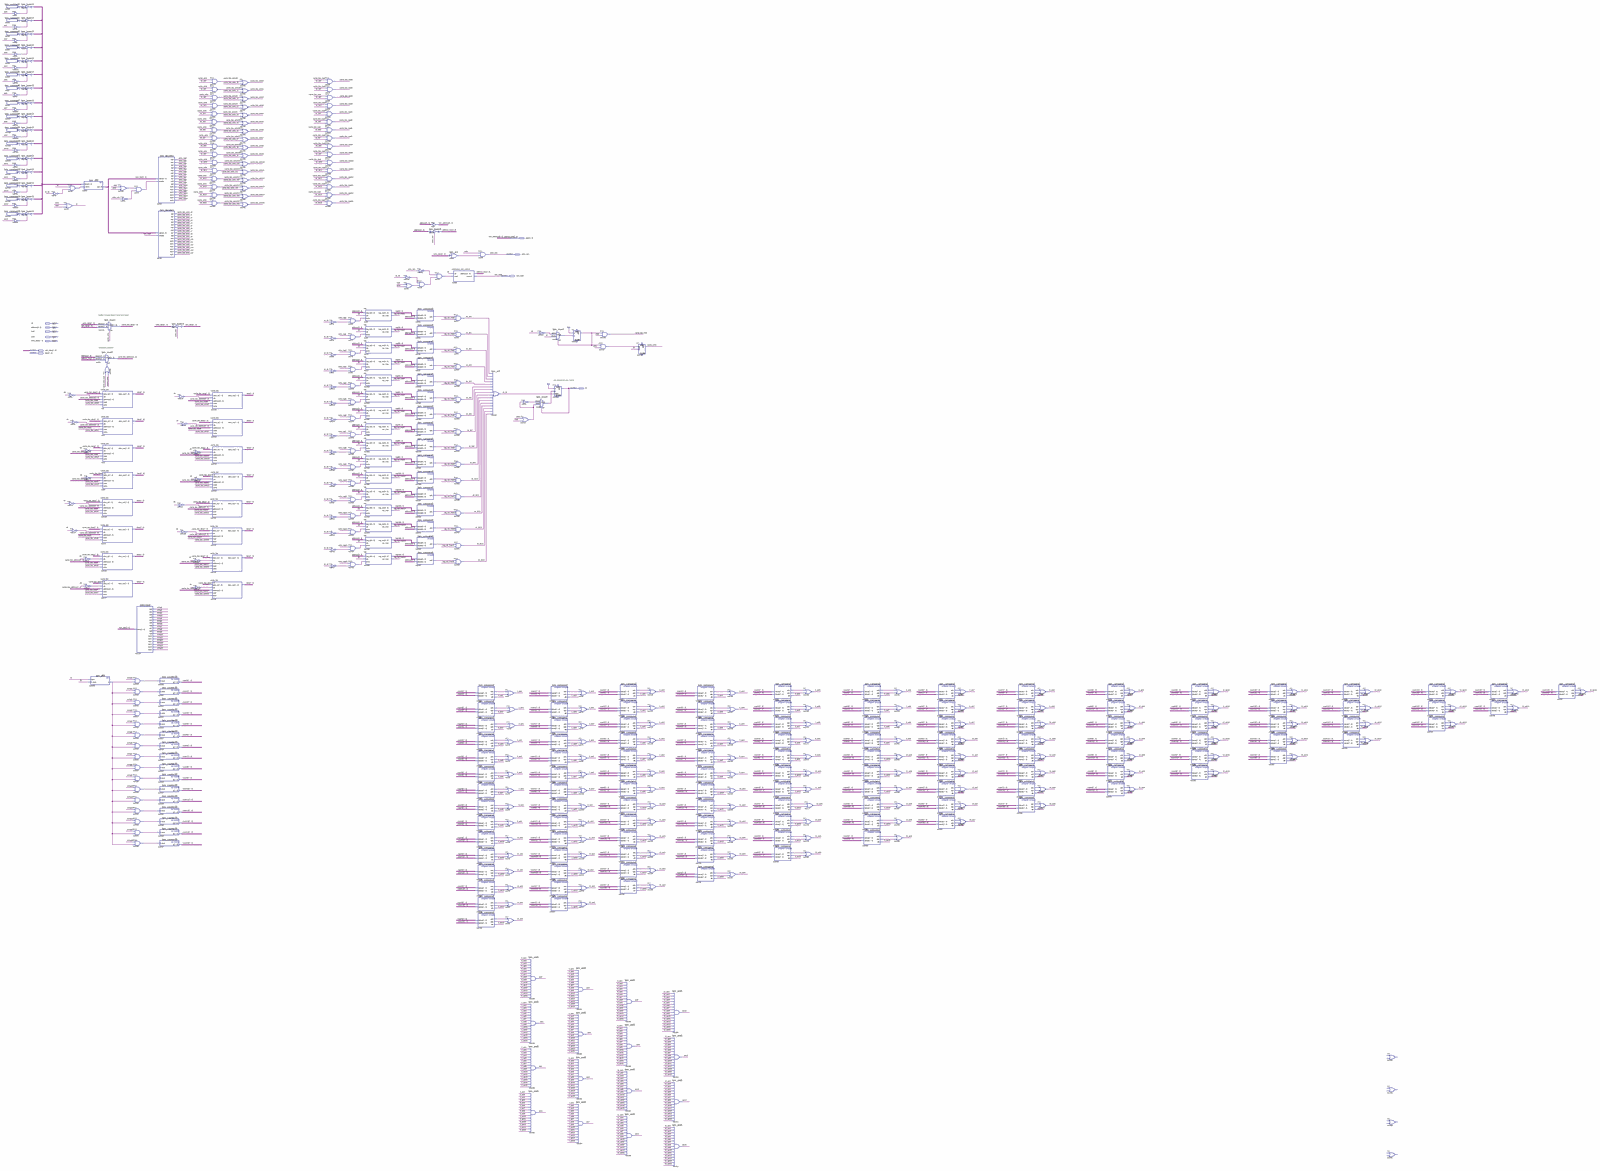
[diagram p0: schematic sheet, whole]
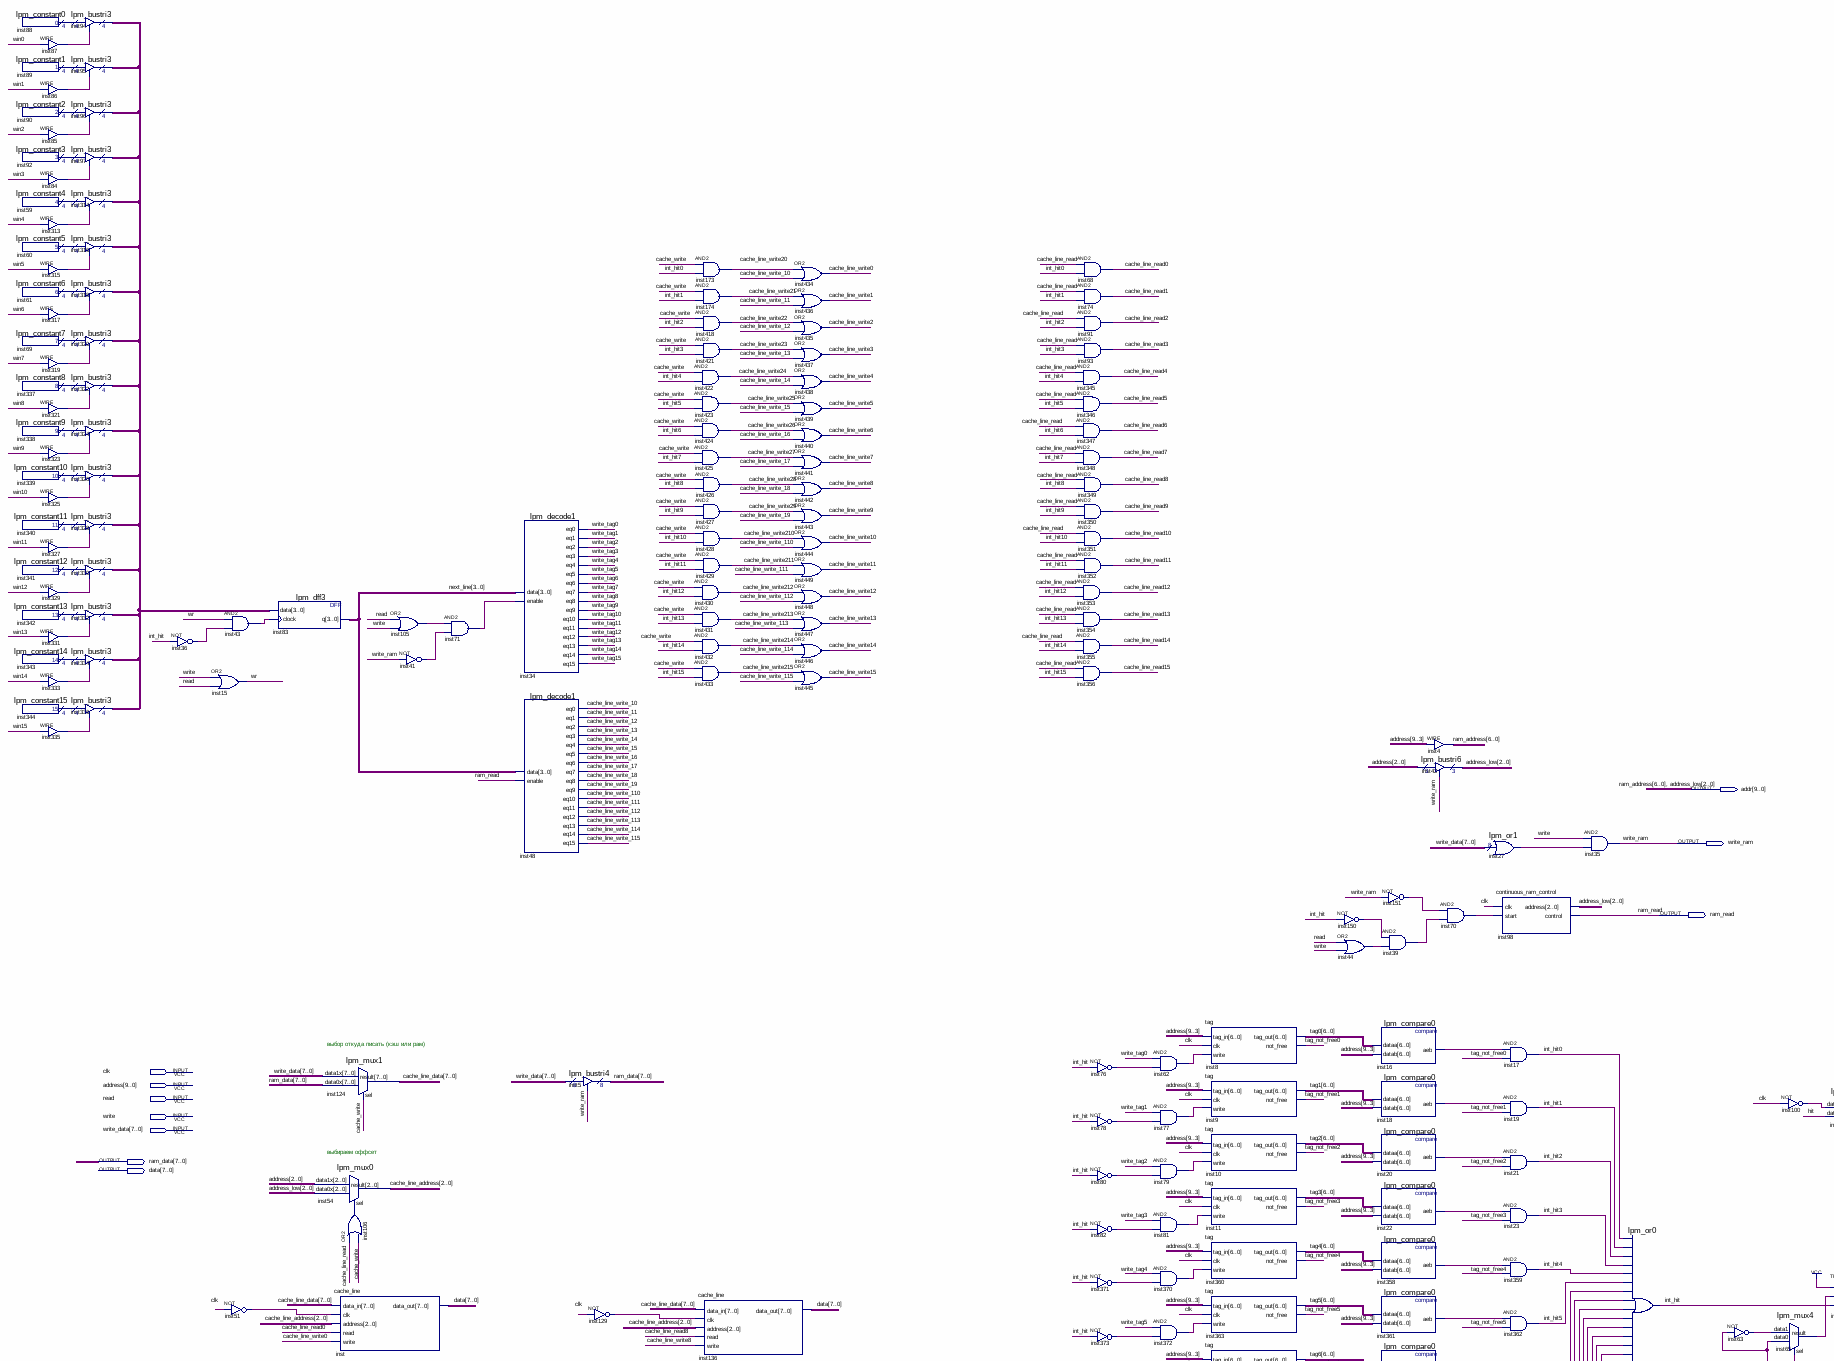
[diagram p1: schematic sheet, upper left part]
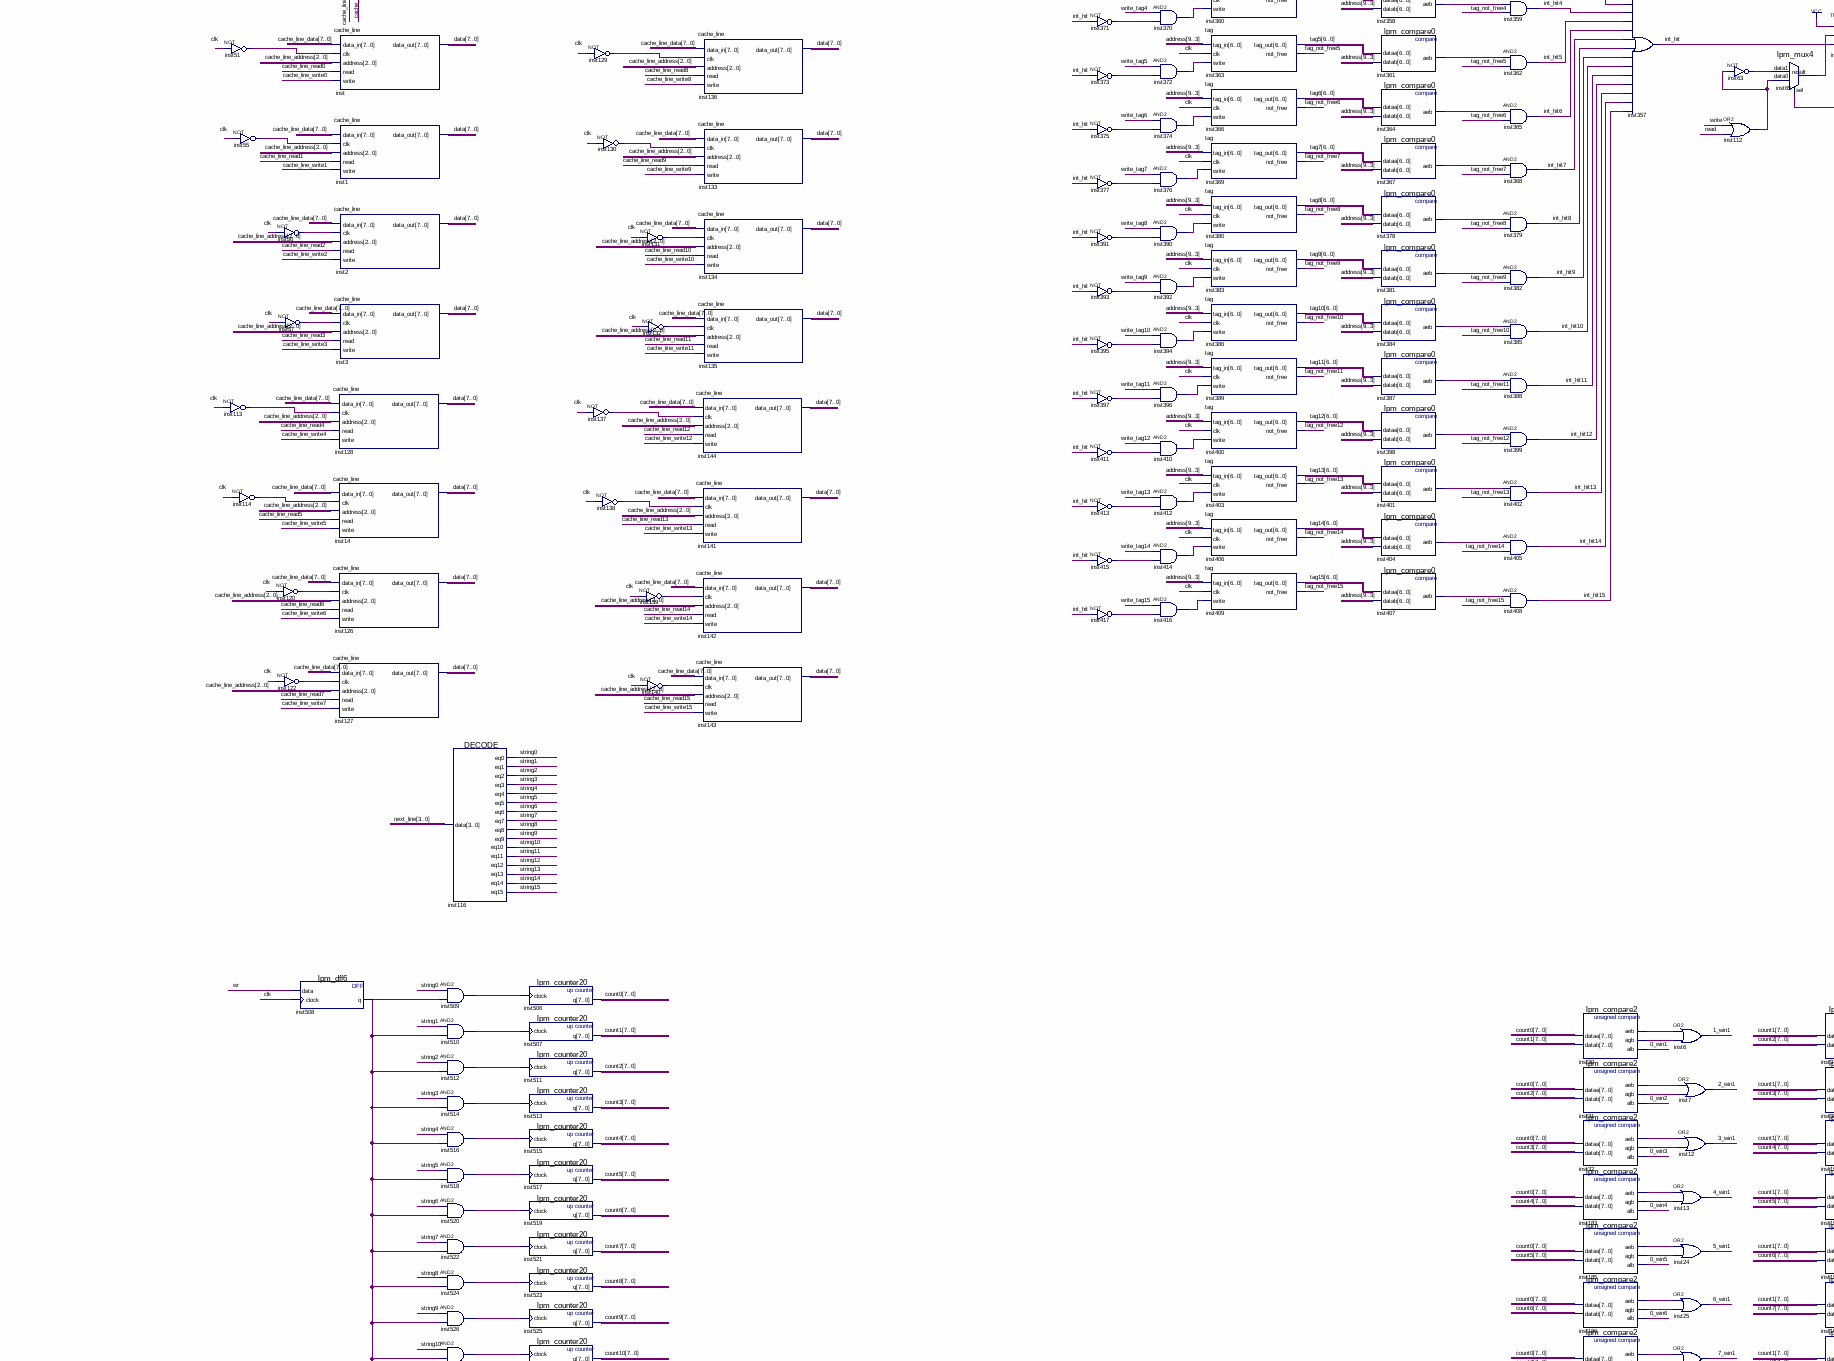
[diagram p2: schematic sheet, middle left part]
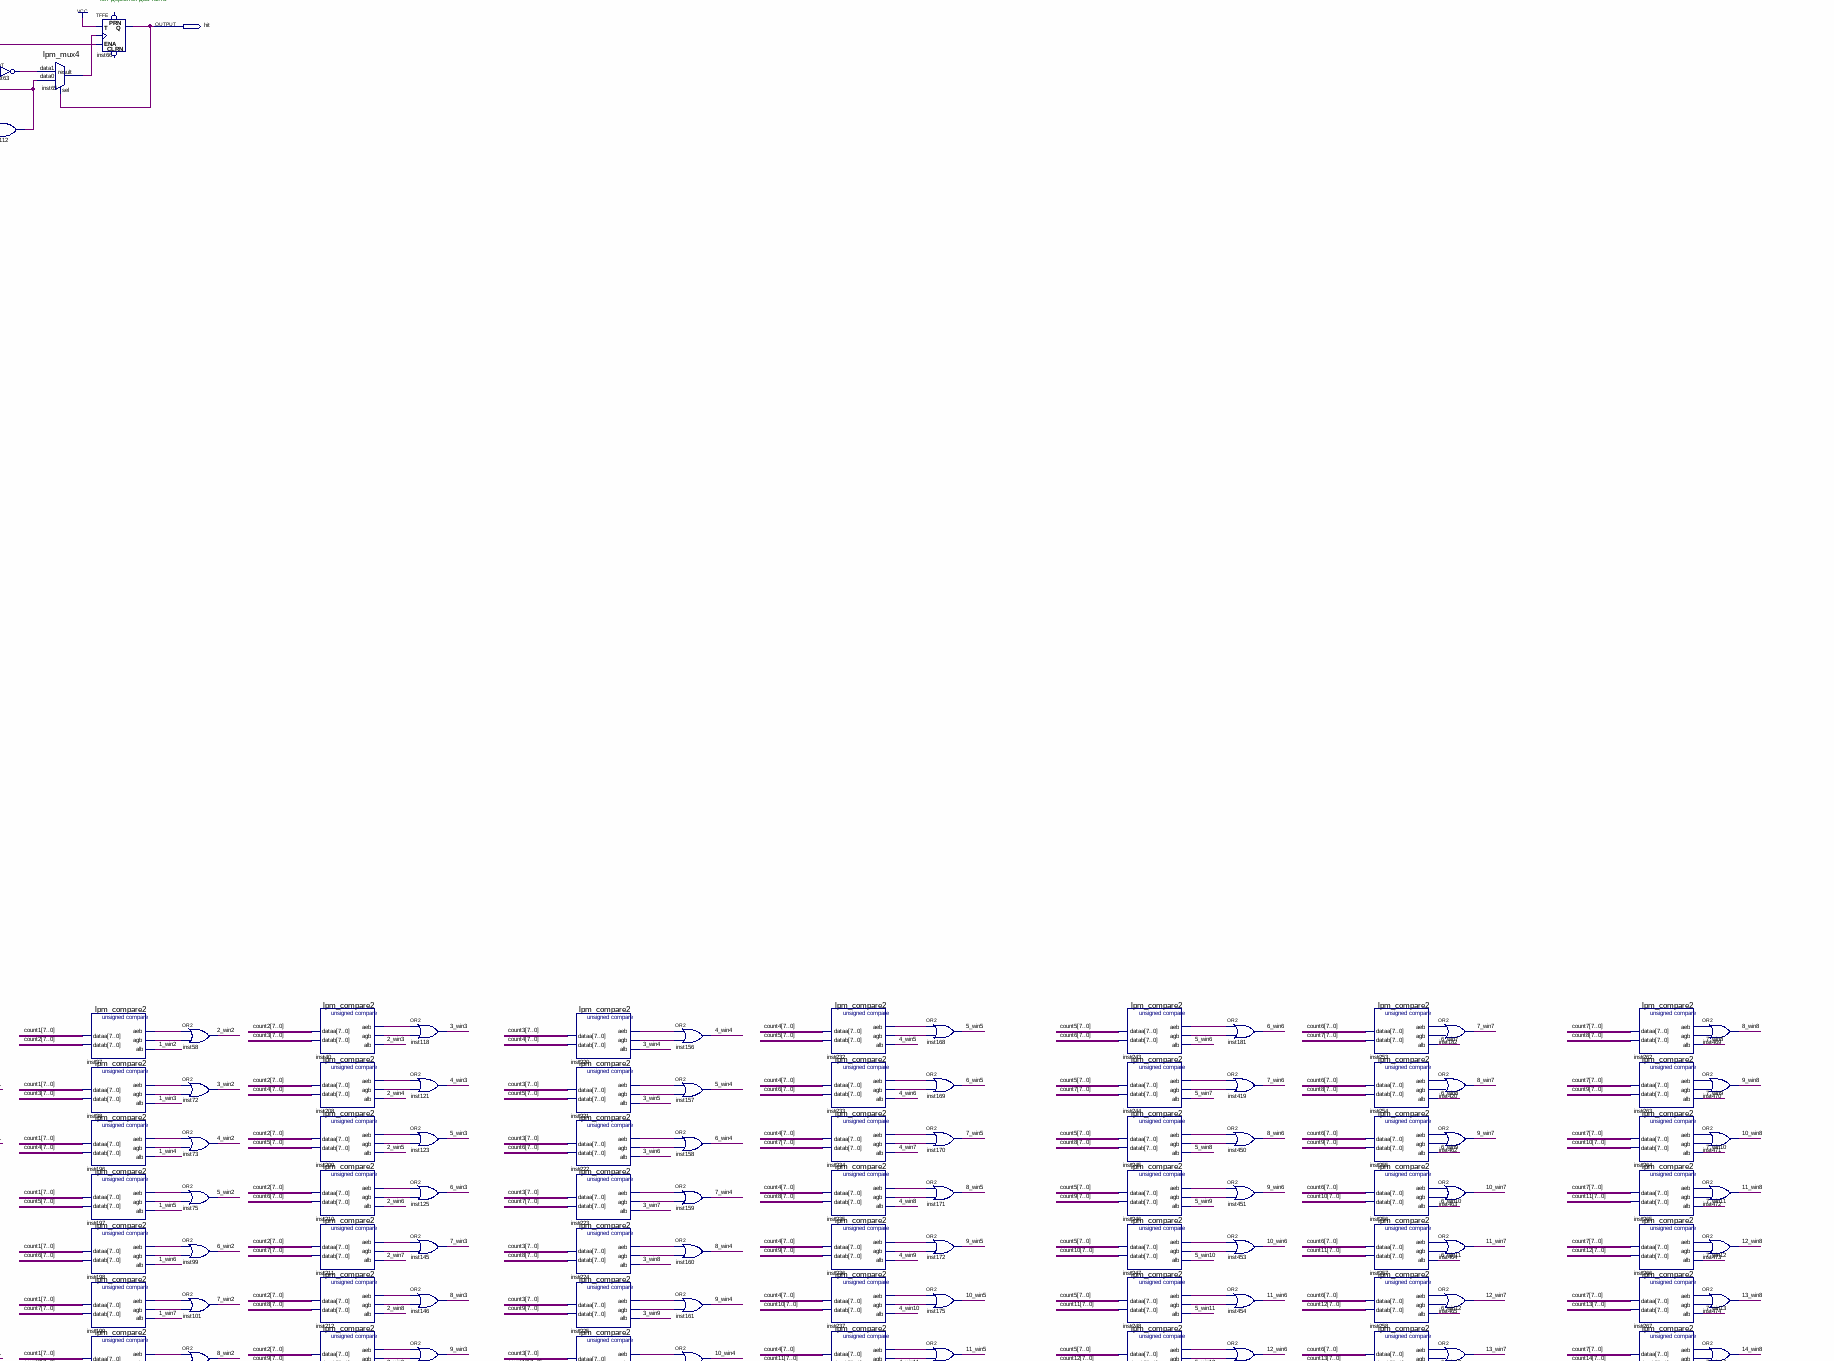
[diagram p3: schematic sheet, middle centre part]
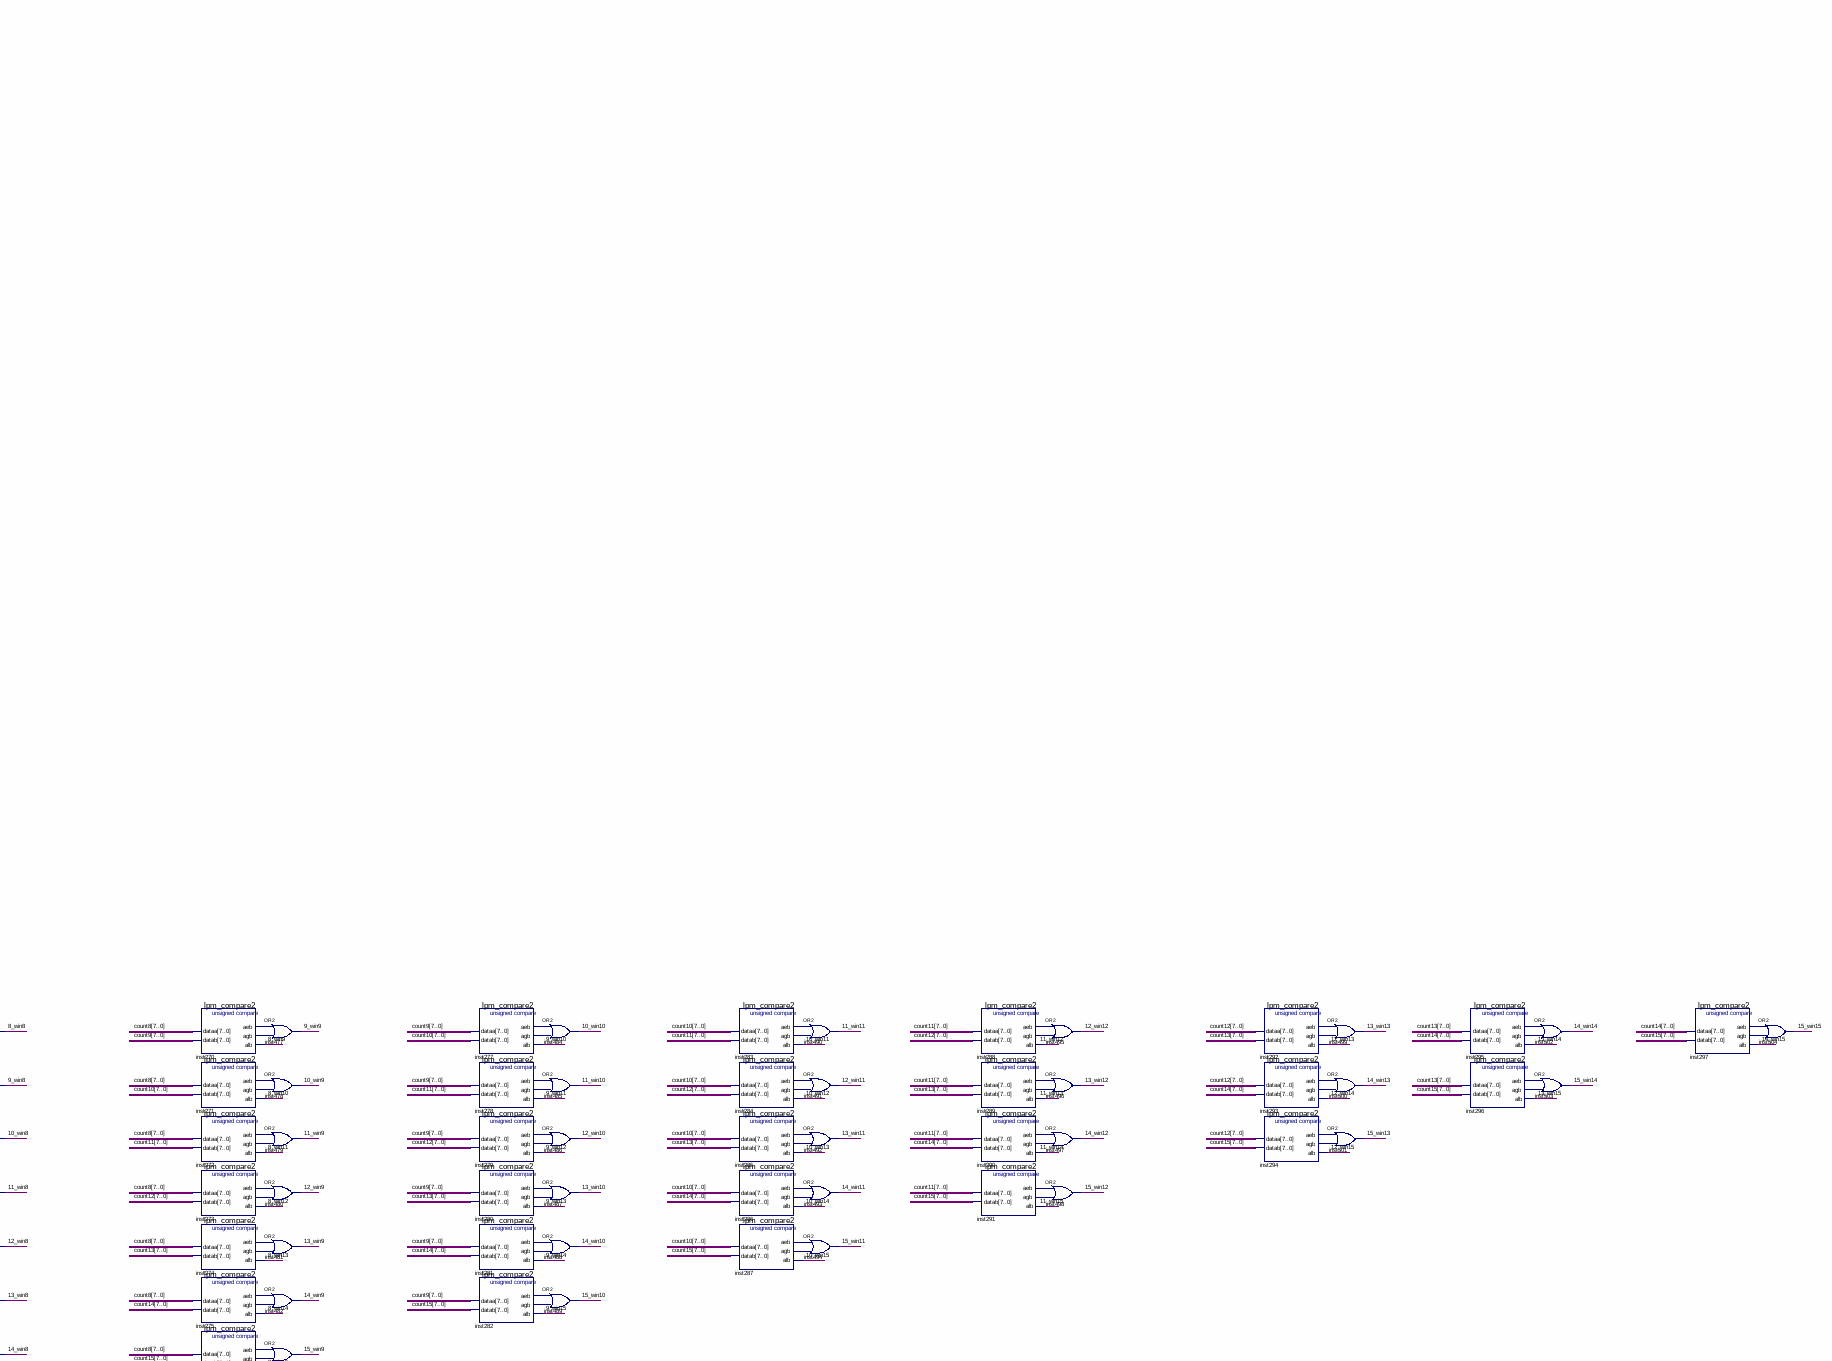
[diagram p4: schematic sheet, middle right part]
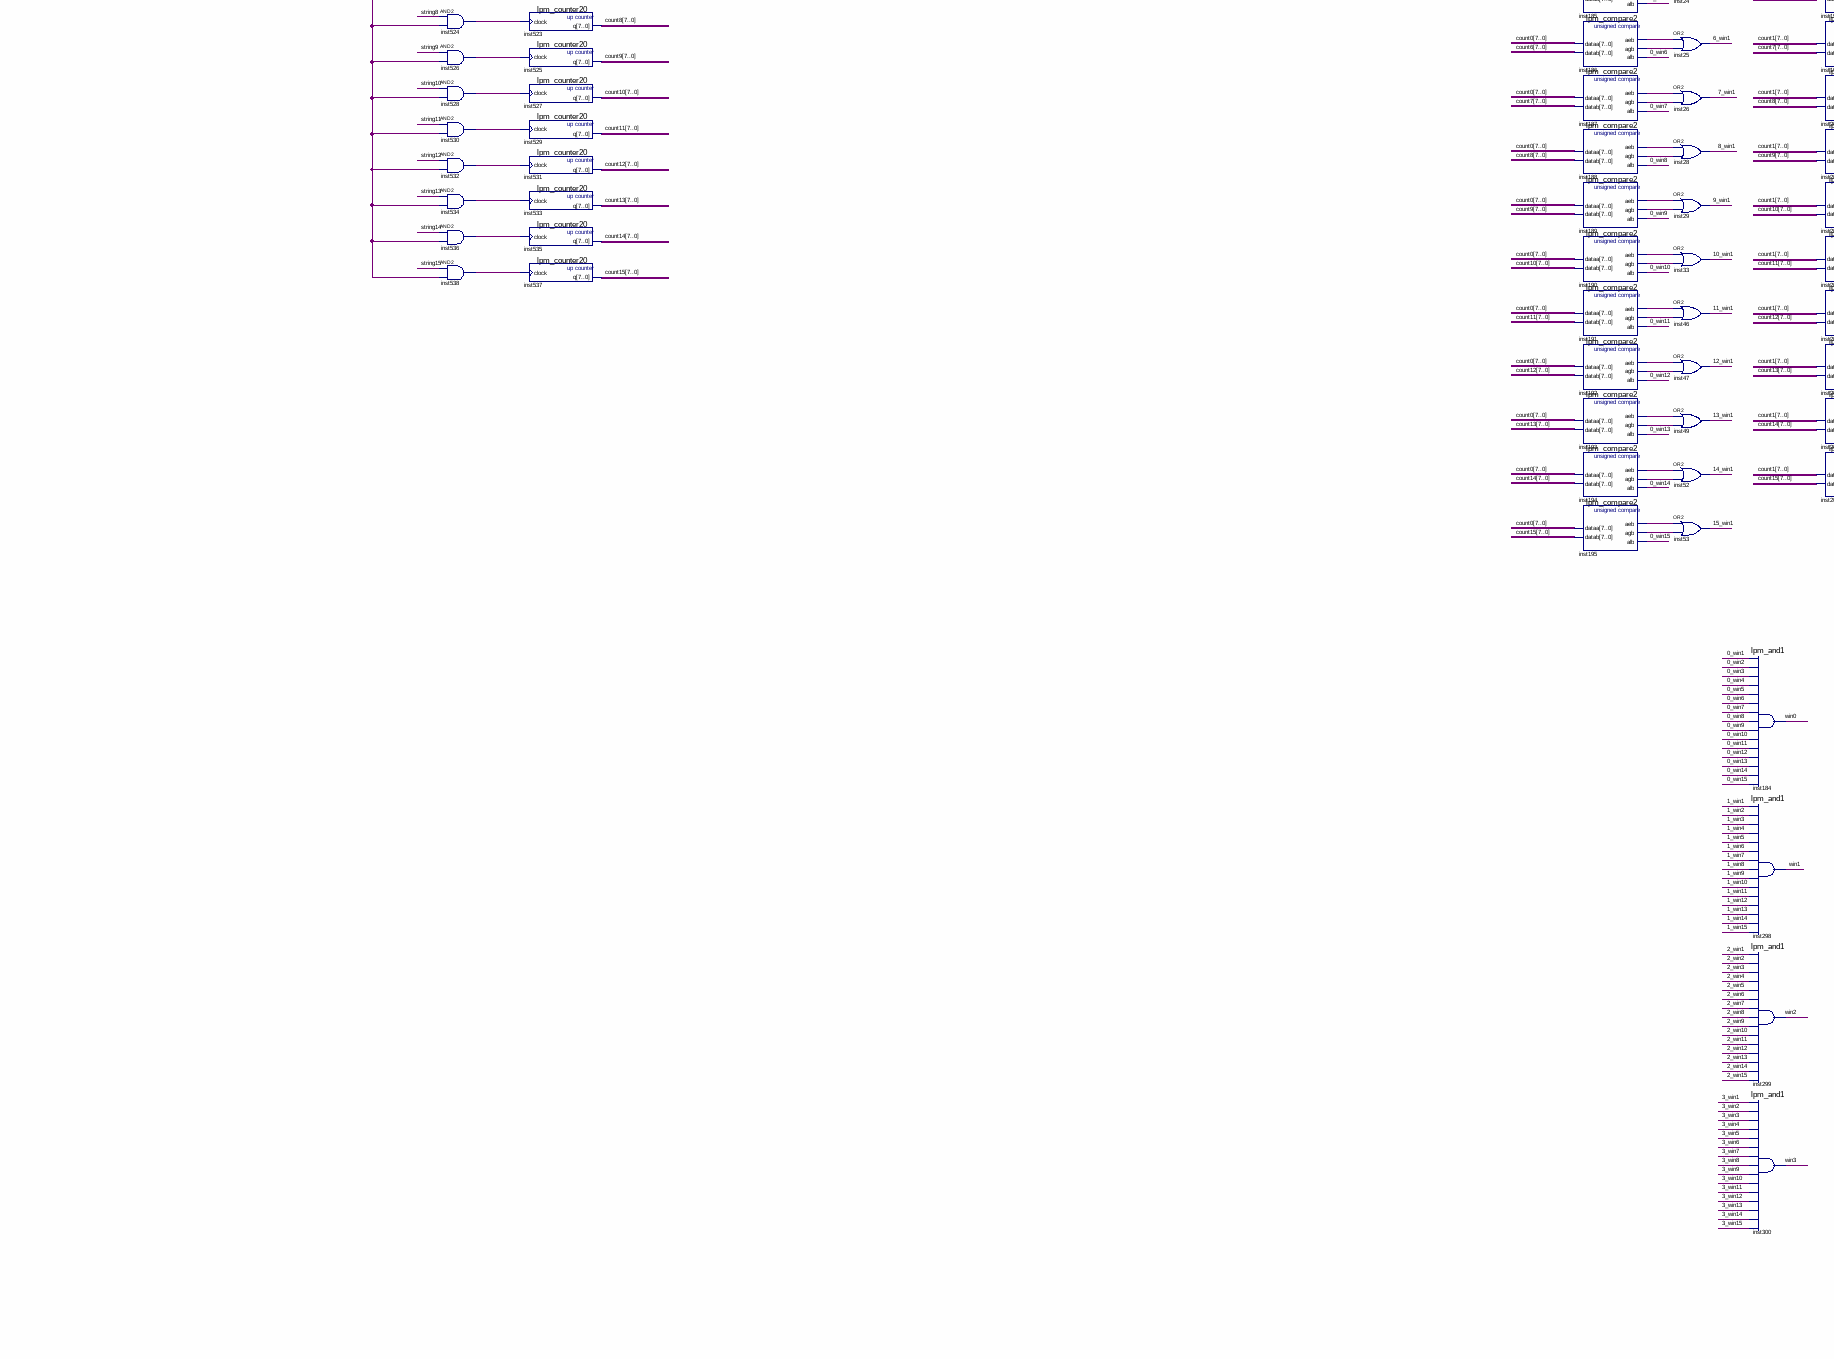
[diagram p5: schematic sheet, lower left part]
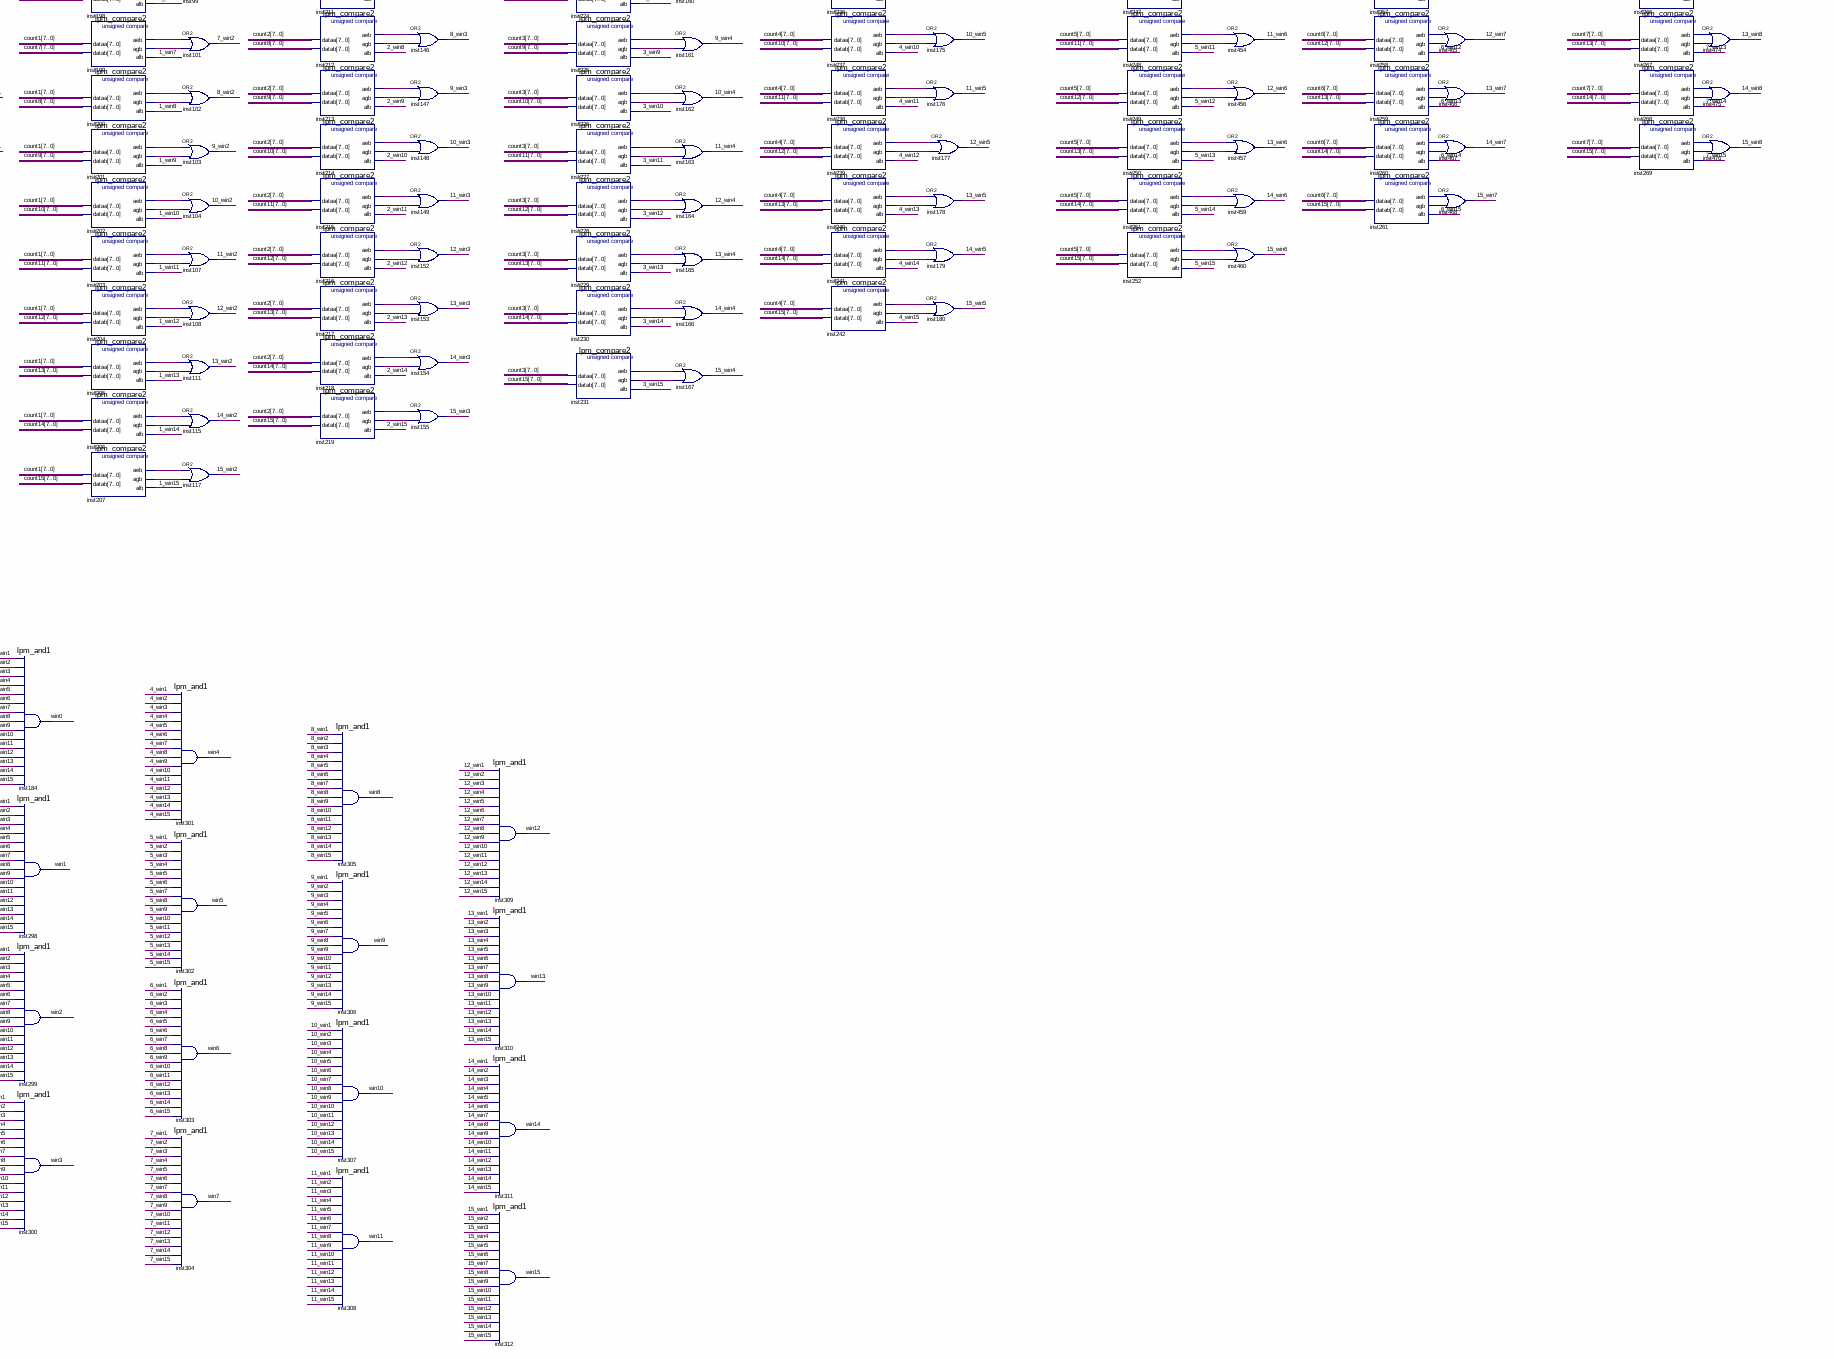
[diagram p6: schematic sheet, lower centre part]
// Quartus schematic cache.bdf as structural Verilog: 536 symbols, 11 pins
module cache (
  input  clk,
  input  [9:0] address,
  input  read,
  input  write,
  input  [7:0] write_data,
  output [9:0] addr,
  output write_ram,
  output ram_read,
  output [7:0] ram_data,
  output [7:0] data,
  output hit
);

  wire \0_win1 , \0_win2 , \0_win3 , \0_win4 , \0_win5 , \0_win6 , \0_win7 , \0_win8 , \0_win9 , \0_win10 ,
       \0_win11 , \0_win12 , \0_win13 , \0_win14 , \0_win15 , \1_win1 , \1_win2 , \1_win3 , \1_win4 ,
       \1_win5 , \1_win6 , \1_win7 , \1_win8 , \1_win9 , \1_win10 , \1_win11 , \1_win12 , \1_win13 ,
       \1_win14 , \1_win15 , \2_win1 , \2_win2 , \2_win3 , \2_win4 , \2_win5 , \2_win6 , \2_win7 , \2_win8 ,
       \2_win9 , \2_win10 , \2_win11 , \2_win12 , \2_win13 , \2_win14 , \2_win15 , \3_win1 , \3_win2 ,
       \3_win3 , \3_win4 , \3_win5 , \3_win6 , \3_win7 , \3_win8 , \3_win9 , \3_win10 , \3_win11 , \3_win12 ,
       \3_win13 , \3_win14 , \3_win15 , \4_win1 , \4_win2 , \4_win3 , \4_win4 , \4_win5 , \4_win6 , \4_win7 ,
       \4_win8 , \4_win9 , \4_win10 , \4_win11 , \4_win12 , \4_win13 , \4_win14 , \4_win15 , \5_win1 ,
       \5_win2 , \5_win3 , \5_win4 , \5_win5 , \5_win6 , \5_win7 , \5_win8 , \5_win9 , \5_win10 , \5_win11 ,
       \5_win12 , \5_win13 , \5_win14 , \5_win15 , \6_win1 , \6_win2 , \6_win3 , \6_win4 , \6_win5 ,
       \6_win6 , \6_win7 , \6_win8 , \6_win9 , \6_win10 , \6_win11 , \6_win12 , \6_win13 , \6_win14 ,
       \6_win15 , \7_win1 , \7_win2 , \7_win3 , \7_win4 , \7_win5 , \7_win6 , \7_win7 , \7_win8 , \7_win9 ,
       \7_win10 , \7_win11 , \7_win12 , \7_win13 , \7_win14 , \7_win15 , \8_win1 , \8_win2 , \8_win3 ,
       \8_win4 , \8_win5 , \8_win6 , \8_win7 , \8_win8 , \8_win9 , \8_win10 , \8_win11 , \8_win12 ,
       \8_win13 , \8_win14 , \8_win15 , \9_win1 , \9_win2 , \9_win3 , \9_win4 , \9_win5 , \9_win6 , \9_win7 ,
       \9_win8 , \9_win9 , \9_win10 , \9_win11 , \9_win12 , \9_win13 , \9_win14 , \9_win15 , \10_win1 ,
       \10_win2 , \10_win3 , \10_win4 , \10_win5 , \10_win6 , \10_win7 , \10_win8 , \10_win9 , \10_win10 ,
       \10_win11 , \10_win12 , \10_win13 , \10_win14 , \10_win15 , \11_win1 , \11_win2 , \11_win3 ,
       \11_win4 , \11_win5 , \11_win6 , \11_win7 , \11_win8 , \11_win9 , \11_win10 , \11_win11 , \11_win12 ,
       \11_win13 , \11_win14 , \11_win15 , \12_win1 , \12_win2 , \12_win3 , \12_win4 , \12_win5 , \12_win6 ,
       \12_win7 , \12_win8 , \12_win9 , \12_win10 , \12_win11 , \12_win12 , \12_win13 , \12_win14 ,
       \12_win15 , \13_win1 , \13_win2 , \13_win3 , \13_win4 , \13_win5 , \13_win6 , \13_win7 , \13_win8 ,
       \13_win9 , \13_win10 , \13_win11 , \13_win12 , \13_win13 , \13_win14 , \13_win15 , \14_win1 ,
       \14_win2 , \14_win3 , \14_win4 , \14_win5 , \14_win6 , \14_win7 , \14_win8 , \14_win9 , \14_win10 ,
       \14_win11 , \14_win12 , \14_win13 , \14_win14 , \14_win15 , \15_win1 , \15_win2 , \15_win3 ,
       \15_win4 , \15_win5 , \15_win6 , \15_win7 , \15_win8 , \15_win9 , \15_win10 , \15_win11 , \15_win12 ,
       \15_win13 , \15_win14 , \15_win15 , cache_line_read, cache_line_read0, cache_line_read1,
       cache_line_read2, cache_line_read3, cache_line_read4, cache_line_read5, cache_line_read6,
       cache_line_read7, cache_line_read8, cache_line_read9, cache_line_read10, cache_line_read11,
       cache_line_read12, cache_line_read13, cache_line_read14, cache_line_read15, cache_line_write0,
       cache_line_write1, cache_line_write2, cache_line_write3, cache_line_write4, cache_line_write5,
       cache_line_write6, cache_line_write7, cache_line_write8, cache_line_write9, cache_line_write10,
       cache_line_write11, cache_line_write12, cache_line_write13, cache_line_write14, cache_line_write15,
       cache_line_write20, cache_line_write21, cache_line_write22, cache_line_write23, cache_line_write24,
       cache_line_write25, cache_line_write26, cache_line_write27, cache_line_write28, cache_line_write29,
       cache_line_write210, cache_line_write211, cache_line_write212, cache_line_write213,
       cache_line_write214, cache_line_write215, cache_line_write_10, cache_line_write_11,
       cache_line_write_12, cache_line_write_13, cache_line_write_14, cache_line_write_15,
       cache_line_write_16, cache_line_write_17, cache_line_write_18, cache_line_write_19,
       cache_line_write_110, cache_line_write_111, cache_line_write_112, cache_line_write_113,
       cache_line_write_114, cache_line_write_115, cache_write, inst16_aeb, inst18_aeb, inst20_aeb,
       inst22_aeb, inst27_result, inst30_aeb, inst30_agb, inst31_aeb, inst31_agb, inst32_aeb, inst32_agb,
       inst36_out, inst37_aeb, inst37_agb, inst38_aeb, inst38_agb, inst39_out, inst40_aeb, inst40_agb,
       inst41_out, inst43_out, inst44_out, inst50_result, inst51_out, inst55_out, inst56_out, inst57_out,
       inst62_out, inst63_out, inst64_q, inst65_result, inst70_out, inst71_out, inst76_out, inst77_out,
       inst78_out, inst79_out, inst80_out, inst81_out, inst82_out, inst84_out, inst85_out, inst86_out,
       inst87_out, inst100_out, inst105_out, inst106_out, inst110_out, inst112_out, inst113_out, inst114_out,
       inst120_out, inst122_out, inst129_out, inst130_out, inst131_out, inst132_out, inst137_out,
       inst138_out, inst139_out, inst140_out, inst150_out, inst151_out, inst183_aeb, inst183_agb,
       inst185_aeb, inst185_agb, inst186_aeb, inst186_agb, inst187_aeb, inst187_agb, inst188_aeb,
       inst188_agb, inst189_aeb, inst189_agb, inst190_aeb, inst190_agb, inst191_aeb, inst191_agb,
       inst192_aeb, inst192_agb, inst193_aeb, inst193_agb, inst194_aeb, inst194_agb, inst195_aeb,
       inst195_agb, inst196_aeb, inst196_agb, inst197_aeb, inst197_agb, inst198_aeb, inst198_agb,
       inst199_aeb, inst199_agb, inst200_aeb, inst200_agb, inst201_aeb, inst201_agb, inst202_aeb,
       inst202_agb, inst203_aeb, inst203_agb, inst204_aeb, inst204_agb, inst205_aeb, inst205_agb,
       inst206_aeb, inst206_agb, inst207_aeb, inst207_agb, inst208_aeb, inst208_agb, inst209_aeb,
       inst209_agb, inst210_aeb, inst210_agb, inst211_aeb, inst211_agb, inst212_aeb, inst212_agb,
       inst213_aeb, inst213_agb, inst214_aeb, inst214_agb, inst215_aeb, inst215_agb, inst216_aeb,
       inst216_agb, inst217_aeb, inst217_agb, inst218_aeb, inst218_agb, inst219_aeb, inst219_agb,
       inst220_aeb, inst220_agb, inst221_aeb, inst221_agb, inst222_aeb, inst222_agb, inst223_aeb,
       inst223_agb, inst224_aeb, inst224_agb, inst225_aeb, inst225_agb, inst226_aeb, inst226_agb,
       inst227_aeb, inst227_agb, inst228_aeb, inst228_agb, inst229_aeb, inst229_agb, inst230_aeb,
       inst230_agb, inst231_aeb, inst231_agb, inst232_aeb, inst232_agb, inst233_aeb, inst233_agb,
       inst234_aeb, inst234_agb, inst235_aeb, inst235_agb, inst236_aeb, inst236_agb, inst237_aeb,
       inst237_agb, inst238_aeb, inst238_agb, inst239_aeb, inst239_agb, inst240_aeb, inst240_agb,
       inst241_aeb, inst241_agb, inst242_aeb, inst242_agb, inst243_aeb, inst243_agb, inst244_aeb,
       inst244_agb, inst245_aeb, inst245_agb, inst246_aeb, inst246_agb, inst247_aeb, inst247_agb,
       inst248_aeb, inst248_agb, inst249_aeb, inst249_agb, inst250_aeb, inst250_agb, inst251_aeb,
       inst251_agb, inst252_aeb, inst252_agb, inst253_aeb, inst253_agb, inst254_aeb, inst254_agb,
       inst255_aeb, inst255_agb, inst256_aeb, inst256_agb, inst257_aeb, inst257_agb, inst258_aeb,
       inst258_agb, inst259_aeb, inst259_agb, inst260_aeb, inst260_agb, inst261_aeb, inst261_agb,
       inst262_aeb, inst262_agb, inst263_aeb, inst263_agb, inst264_aeb, inst264_agb, inst265_aeb,
       inst265_agb, inst266_aeb, inst266_agb, inst267_aeb, inst267_agb, inst268_aeb, inst268_agb,
       inst269_aeb, inst269_agb, inst270_aeb, inst270_agb, inst271_aeb, inst271_agb, inst272_aeb,
       inst272_agb, inst273_aeb, inst273_agb, inst274_aeb, inst274_agb, inst275_aeb, inst275_agb,
       inst276_aeb, inst276_agb, inst277_aeb, inst277_agb, inst278_aeb, inst278_agb, inst279_aeb,
       inst279_agb, inst280_aeb, inst280_agb, inst281_aeb, inst281_agb, inst282_aeb, inst282_agb,
       inst283_aeb, inst283_agb, inst284_aeb, inst284_agb, inst285_aeb, inst285_agb, inst286_aeb,
       inst286_agb, inst287_aeb, inst287_agb, inst288_aeb, inst288_agb, inst289_aeb, inst289_agb,
       inst290_aeb, inst290_agb, inst291_aeb, inst291_agb, inst292_aeb, inst292_agb, inst293_aeb,
       inst293_agb, inst294_aeb, inst294_agb, inst295_aeb, inst295_agb, inst296_aeb, inst296_agb,
       inst297_aeb, inst297_agb, inst313_out, inst315_out, inst317_out, inst319_out, inst321_out,
       inst323_out, inst325_out, inst327_out, inst329_out, inst331_out, inst333_out, inst335_out,
       inst358_aeb, inst361_aeb, inst364_aeb, inst367_aeb, inst370_out, inst371_out, inst372_out,
       inst373_out, inst374_out, inst375_out, inst376_out, inst377_out, inst378_aeb, inst381_aeb,
       inst384_aeb, inst387_aeb, inst390_out, inst391_out, inst392_out, inst393_out, inst394_out,
       inst395_out, inst396_out, inst397_out, inst398_aeb, inst401_aeb, inst404_aeb, inst407_aeb,
       inst410_out, inst411_out, inst412_out, inst413_out, inst414_out, inst415_out, inst416_out,
       inst417_out, inst508_q, inst509_out, inst510_out, inst512_out, inst514_out, inst516_out, inst518_out,
       inst520_out, inst522_out, inst524_out, inst526_out, inst528_out, inst530_out, inst532_out,
       inst534_out, inst536_out, inst538_out, int_hit, int_hit0, int_hit1, int_hit2, int_hit3, int_hit4,
       int_hit5, int_hit6, int_hit7, int_hit8, int_hit9, int_hit10, int_hit11, int_hit12, int_hit13,
       int_hit14, int_hit15, string0, string1, string2, string3, string4, string5, string6, string7, string8,
       string9, string10, string11, string12, string13, string14, string15, tag_not_free0, tag_not_free1,
       tag_not_free2, tag_not_free3, tag_not_free4, tag_not_free5, tag_not_free6, tag_not_free7,
       tag_not_free8, tag_not_free9, tag_not_free10, tag_not_free11, tag_not_free12, tag_not_free13,
       tag_not_free14, tag_not_free15, win0, win1, win2, win3, win4, win5, win6, win7, win8, win9, win10,
       win11, win12, win13, win14, win15, wr, write_tag0, write_tag1, write_tag2, write_tag3, write_tag4,
       write_tag5, write_tag6, write_tag7, write_tag8, write_tag9, write_tag10, write_tag11, write_tag12,
       write_tag13, write_tag14, write_tag15;
  wire [2:0] cache_line_address;
  wire [3:0] inst59_result, inst60_result, inst61_result, inst69_result, inst88_result, inst89_result,
       inst90_result, inst92_result, inst94_tridata, inst337_result, inst338_result, inst339_result,
       inst340_result, inst341_result, inst342_result, inst343_result, inst344_result, next_line;
  wire [6:0] tag0, tag1, tag2, tag3, tag4, tag5, tag6, tag7, tag8, tag9, tag10, tag11, tag12, tag13, tag14,
       tag15;
  wire [7:0] cache_line_data, count0, count1, count2, count3, count4, count5, count6, count7, count8, count9,
       count10, count11, count12, count13, count14, count15;

  lpm_constant0 inst88 (.result(inst88_result));
  lpm_constant1 inst89 (.result(inst89_result));
  lpm_constant2 inst90 (.result(inst90_result));
  lpm_constant3 inst92 (.result(inst92_result));
  lpm_constant4 inst59 (.result(inst59_result));
  lpm_constant5 inst60 (.result(inst60_result));
  lpm_constant6 inst61 (.result(inst61_result));
  lpm_constant7 inst69 (.result(inst69_result));
  lpm_constant8 inst337 (.result(inst337_result));
  lpm_constant9 inst338 (.result(inst338_result));
  lpm_constant10 inst339 (.result(inst339_result));
  lpm_constant11 inst340 (.result(inst340_result));
  lpm_constant12 inst341 (.result(inst341_result));
  lpm_constant13 inst342 (.result(inst342_result));
  lpm_constant14 inst343 (.result(inst343_result));
  lpm_constant15 inst344 (.result(inst344_result));
  assign inst87_out = win0;  // WIRE inst87
  assign inst86_out = win1;  // WIRE inst86
  assign inst85_out = win2;  // WIRE inst85
  assign inst84_out = win3;  // WIRE inst84
  assign inst313_out = win4;  // WIRE inst313
  assign inst315_out = win5;  // WIRE inst315
  assign inst317_out = win6;  // WIRE inst317
  assign inst319_out = win7;  // WIRE inst319
  assign inst321_out = win8;  // WIRE inst321
  assign inst323_out = win9;  // WIRE inst323
  assign inst325_out = win10;  // WIRE inst325
  assign inst327_out = win11;  // WIRE inst327
  assign inst329_out = win12;  // WIRE inst329
  assign inst331_out = win13;  // WIRE inst331
  assign inst333_out = win14;  // WIRE inst333
  assign inst335_out = win15;  // WIRE inst335
  lpm_bustri3 inst94 (.enabledt(inst87_out), .data(inst88_result), .tridata(inst94_tridata));
  lpm_bustri3 inst95 (.enabledt(inst86_out), .data(inst89_result), .tridata(inst94_tridata));
  lpm_bustri3 inst96 (.enabledt(inst85_out), .data(inst90_result), .tridata(inst94_tridata));
  lpm_bustri3 inst97 (.enabledt(inst84_out), .data(inst92_result), .tridata(inst94_tridata));
  lpm_bustri3 inst314 (.enabledt(inst313_out), .data(inst59_result), .tridata(inst94_tridata));
  lpm_bustri3 inst316 (.enabledt(inst315_out), .data(inst60_result), .tridata(inst94_tridata));
  lpm_bustri3 inst318 (.enabledt(inst317_out), .data(inst61_result), .tridata(inst94_tridata));
  lpm_bustri3 inst320 (.enabledt(inst319_out), .data(inst69_result), .tridata(inst94_tridata));
  lpm_bustri3 inst322 (.enabledt(inst321_out), .data(inst337_result), .tridata(inst94_tridata));
  lpm_bustri3 inst324 (.enabledt(inst323_out), .data(inst338_result), .tridata(inst94_tridata));
  lpm_bustri3 inst326 (.enabledt(inst325_out), .data(inst339_result), .tridata(inst94_tridata));
  lpm_bustri3 inst328 (.enabledt(inst327_out), .data(inst340_result), .tridata(inst94_tridata));
  lpm_bustri3 inst330 (.enabledt(inst329_out), .data(inst341_result), .tridata(inst94_tridata));
  lpm_bustri3 inst332 (.enabledt(inst331_out), .data(inst342_result), .tridata(inst94_tridata));
  lpm_bustri3 inst334 (.enabledt(inst333_out), .data(inst343_result), .tridata(inst94_tridata));
  lpm_bustri3 inst336 (.enabledt(inst335_out), .data(inst344_result), .tridata(inst94_tridata));
  not inst36 (inst36_out, int_hit);
  and inst43 (inst43_out, wr, inst36_out);
  or inst15 (wr, write, read);
  not inst51 (inst51_out, clk);
  not inst55 (inst55_out, clk);
  not inst113 (inst113_out, clk);
  not inst114 (inst114_out, clk);
  lpm_dff3 inst83 (.data(inst94_tridata), .clock(inst43_out), .q(next_line));
  not inst56 (inst56_out, clk);
  not inst120 (inst120_out, clk);
  not inst122 (inst122_out, clk);
  not inst57 (inst57_out, clk);
  lpm_dff6 inst508 (.data(wr), .clock(clk), .q(inst508_q));
  lpm_mux1 inst124 (.data1x(write_data), .data0x(ram_data), .sel(cache_write), .result(cache_line_data));
  lpm_mux0 inst54 (.data1x(address[2:0]), .data0x(addr[2:0]), .sel(inst106_out), .result(cache_line_address));
  or inst106 (inst106_out, cache_line_read, cache_write);
  cache_line inst (
    .data_in(cache_line_data), .clk(inst51_out), .address(cache_line_address), .read(cache_line_read0),
    .write(cache_line_write0), .data_out(data));
  cache_line inst1 (
    .data_in(cache_line_data), .clk(inst55_out), .address(cache_line_address), .read(cache_line_read1),
    .write(cache_line_write1), .data_out(data));
  cache_line inst2 (
    .data_in(cache_line_data), .clk(inst56_out), .address(cache_line_address), .read(cache_line_read2),
    .write(cache_line_write2), .data_out(data));
  cache_line inst3 (
    .data_in(cache_line_data), .clk(inst57_out), .address(cache_line_address), .read(cache_line_read3),
    .write(cache_line_write3), .data_out(data));
  cache_line inst128 (
    .data_in(cache_line_data), .clk(inst113_out), .address(cache_line_address), .read(cache_line_read4),
    .write(cache_line_write4), .data_out(data));
  cache_line inst14 (
    .data_in(cache_line_data), .clk(inst114_out), .address(cache_line_address), .read(cache_line_read5),
    .write(cache_line_write5), .data_out(data));
  cache_line inst126 (
    .data_in(cache_line_data), .clk(inst120_out), .address(cache_line_address), .read(cache_line_read6),
    .write(cache_line_write6), .data_out(data));
  cache_line inst127 (
    .data_in(cache_line_data), .clk(inst122_out), .address(cache_line_address), .read(cache_line_read7),
    .write(cache_line_write7), .data_out(data));
  or inst105 (inst105_out, read, write);
  not inst41 (inst41_out, write_ram);
  and inst71 (inst71_out, inst105_out, inst41_out);
  DECODE inst116 (
    .data(next_line), .eq0(string0), .eq1(string1), .eq2(string2), .eq3(string3), .eq4(string4),
    .eq5(string5), .eq6(string6), .eq7(string7), .eq8(string8), .eq9(string9), .eq10(string10),
    .eq11(string11), .eq12(string12), .eq13(string13), .eq14(string14), .eq15(string15));
  and inst509 (inst509_out, string0, inst508_q);
  and inst510 (inst510_out, string1, inst508_q);
  and inst512 (inst512_out, string2, inst508_q);
  and inst514 (inst514_out, string3, inst508_q);
  and inst516 (inst516_out, string4, inst508_q);
  and inst518 (inst518_out, string5, inst508_q);
  and inst520 (inst520_out, string6, inst508_q);
  and inst522 (inst522_out, string7, inst508_q);
  and inst524 (inst524_out, string8, inst508_q);
  and inst526 (inst526_out, string9, inst508_q);
  and inst528 (inst528_out, string10, inst508_q);
  and inst530 (inst530_out, string11, inst508_q);
  and inst532 (inst532_out, string12, inst508_q);
  and inst534 (inst534_out, string13, inst508_q);
  and inst536 (inst536_out, string14, inst508_q);
  and inst538 (inst538_out, string15, inst508_q);
  lpm_decode1 inst34 (
    .data(next_line), .enable(inst71_out), .eq0(write_tag0), .eq1(write_tag1), .eq2(write_tag2),
    .eq3(write_tag3), .eq4(write_tag4), .eq5(write_tag5), .eq6(write_tag6), .eq7(write_tag7),
    .eq8(write_tag8), .eq9(write_tag9), .eq10(write_tag10), .eq11(write_tag11), .eq12(write_tag12),
    .eq13(write_tag13), .eq14(write_tag14), .eq15(write_tag15));
  lpm_decode1 inst48 (
    .data(next_line), .enable(ram_read), .eq0(cache_line_write_10), .eq1(cache_line_write_11),
    .eq2(cache_line_write_12), .eq3(cache_line_write_13), .eq4(cache_line_write_14),
    .eq5(cache_line_write_15), .eq6(cache_line_write_16), .eq7(cache_line_write_17),
    .eq8(cache_line_write_18), .eq9(cache_line_write_19), .eq10(cache_line_write_110),
    .eq11(cache_line_write_111), .eq12(cache_line_write_112), .eq13(cache_line_write_113),
    .eq14(cache_line_write_114), .eq15(cache_line_write_115));
  lpm_counter20 inst506 (.clock(inst509_out), .q(count0));
  lpm_counter20 inst507 (.clock(inst510_out), .q(count1));
  lpm_counter20 inst511 (.clock(inst512_out), .q(count2));
  lpm_counter20 inst513 (.clock(inst514_out), .q(count3));
  lpm_counter20 inst515 (.clock(inst516_out), .q(count4));
  lpm_counter20 inst517 (.clock(inst518_out), .q(count5));
  lpm_counter20 inst519 (.clock(inst520_out), .q(count6));
  lpm_counter20 inst521 (.clock(inst522_out), .q(count7));
  lpm_counter20 inst523 (.clock(inst524_out), .q(count8));
  lpm_counter20 inst525 (.clock(inst526_out), .q(count9));
  lpm_counter20 inst527 (.clock(inst528_out), .q(count10));
  lpm_counter20 inst529 (.clock(inst530_out), .q(count11));
  lpm_counter20 inst531 (.clock(inst532_out), .q(count12));
  lpm_counter20 inst533 (.clock(inst534_out), .q(count13));
  lpm_counter20 inst535 (.clock(inst536_out), .q(count14));
  lpm_counter20 inst537 (.clock(inst538_out), .q(count15));
  lpm_bustri4 inst5 (.enabledt(write_ram), .data(write_data), .tridata(ram_data));
  not inst129 (inst129_out, clk);
  not inst130 (inst130_out, clk);
  not inst137 (inst137_out, clk);
  not inst138 (inst138_out, clk);
  not inst131 (inst131_out, clk);
  not inst132 (inst132_out, clk);
  not inst139 (inst139_out, clk);
  not inst140 (inst140_out, clk);
  and inst173 (cache_line_write20, cache_write, int_hit0);
  and inst174 (cache_line_write21, cache_write, int_hit1);
  and inst418 (cache_line_write22, cache_write, int_hit2);
  and inst421 (cache_line_write23, cache_write, int_hit3);
  and inst422 (cache_line_write24, cache_write, int_hit4);
  and inst423 (cache_line_write25, cache_write, int_hit5);
  and inst424 (cache_line_write26, cache_write, int_hit6);
  and inst425 (cache_line_write27, cache_write, int_hit7);
  and inst426 (cache_line_write28, cache_write, int_hit8);
  and inst427 (cache_line_write29, cache_write, int_hit9);
  and inst428 (cache_line_write210, cache_write, int_hit10);
  and inst429 (cache_line_write211, cache_write, int_hit11);
  and inst430 (cache_line_write212, cache_write, int_hit12);
  and inst431 (cache_line_write213, cache_write, int_hit13);
  and inst432 (cache_line_write214, cache_write, int_hit14);
  and inst433 (cache_line_write215, cache_write, int_hit15);
  cache_line inst136 (
    .data_in(cache_line_data), .clk(inst129_out), .address(cache_line_address), .read(cache_line_read8),
    .write(cache_line_write8), .data_out(data));
  cache_line inst133 (
    .data_in(cache_line_data), .clk(inst130_out), .address(cache_line_address), .read(cache_line_read9),
    .write(cache_line_write9), .data_out(data));
  cache_line inst134 (
    .data_in(cache_line_data), .clk(inst131_out), .address(cache_line_address), .read(cache_line_read10),
    .write(cache_line_write10), .data_out(data));
  cache_line inst135 (
    .data_in(cache_line_data), .clk(inst132_out), .address(cache_line_address), .read(cache_line_read11),
    .write(cache_line_write11), .data_out(data));
  cache_line inst144 (
    .data_in(cache_line_data), .clk(inst137_out), .address(cache_line_address), .read(cache_line_read12),
    .write(cache_line_write12), .data_out(data));
  cache_line inst141 (
    .data_in(cache_line_data), .clk(inst138_out), .address(cache_line_address), .read(cache_line_read13),
    .write(cache_line_write13), .data_out(data));
  cache_line inst142 (
    .data_in(cache_line_data), .clk(inst139_out), .address(cache_line_address), .read(cache_line_read14),
    .write(cache_line_write14), .data_out(data));
  cache_line inst143 (
    .data_in(cache_line_data), .clk(inst140_out), .address(cache_line_address), .read(cache_line_read15),
    .write(cache_line_write15), .data_out(data));
  or inst434 (cache_line_write0, cache_line_write20, cache_line_write_10);
  or inst436 (cache_line_write1, cache_line_write21, cache_line_write_11);
  or inst435 (cache_line_write2, cache_line_write22, cache_line_write_12);
  or inst437 (cache_line_write3, cache_line_write23, cache_line_write_13);
  or inst438 (cache_line_write4, cache_line_write24, cache_line_write_14);
  or inst439 (cache_line_write5, cache_line_write25, cache_line_write_15);
  or inst440 (cache_line_write6, cache_line_write26, cache_line_write_16);
  or inst441 (cache_line_write7, cache_line_write27, cache_line_write_17);
  or inst442 (cache_line_write8, cache_line_write28, cache_line_write_18);
  or inst443 (cache_line_write9, cache_line_write29, cache_line_write_19);
  or inst444 (cache_line_write10, cache_line_write210, cache_line_write_110);
  or inst449 (cache_line_write11, cache_line_write211, cache_line_write_111);
  or inst448 (cache_line_write12, cache_line_write212, cache_line_write_112);
  or inst447 (cache_line_write13, cache_line_write213, cache_line_write_113);
  or inst446 (cache_line_write14, cache_line_write214, cache_line_write_114);
  or inst445 (cache_line_write15, cache_line_write215, cache_line_write_115);
  and inst68 (cache_line_read0, cache_line_read, int_hit0);
  and inst74 (cache_line_read1, cache_line_read, int_hit1);
  and inst91 (cache_line_read2, cache_line_read, int_hit2);
  and inst93 (cache_line_read3, cache_line_read, int_hit3);
  and inst345 (cache_line_read4, cache_line_read, int_hit4);
  and inst346 (cache_line_read5, cache_line_read, int_hit5);
  and inst347 (cache_line_read6, cache_line_read, int_hit6);
  and inst348 (cache_line_read7, cache_line_read, int_hit7);
  and inst349 (cache_line_read8, cache_line_read, int_hit8);
  and inst350 (cache_line_read9, cache_line_read, int_hit9);
  and inst351 (cache_line_read10, cache_line_read, int_hit10);
  and inst352 (cache_line_read11, cache_line_read, int_hit11);
  and inst353 (cache_line_read12, cache_line_read, int_hit12);
  and inst354 (cache_line_read13, cache_line_read, int_hit13);
  and inst355 (cache_line_read14, cache_line_read, int_hit14);
  and inst356 (cache_line_read15, cache_line_read, int_hit15);
  not inst76 (inst76_out, int_hit);
  not inst78 (inst78_out, int_hit);
  not inst80 (inst80_out, int_hit);
  not inst82 (inst82_out, int_hit);
  not inst371 (inst371_out, int_hit);
  not inst373 (inst373_out, int_hit);
  not inst375 (inst375_out, int_hit);
  not inst377 (inst377_out, int_hit);
  not inst391 (inst391_out, int_hit);
  not inst393 (inst393_out, int_hit);
  not inst395 (inst395_out, int_hit);
  not inst397 (inst397_out, int_hit);
  not inst411 (inst411_out, int_hit);
  not inst413 (inst413_out, int_hit);
  not inst415 (inst415_out, int_hit);
  not inst417 (inst417_out, int_hit);
  and inst62 (inst62_out, write_tag0, inst76_out);
  and inst77 (inst77_out, write_tag1, inst78_out);
  and inst79 (inst79_out, write_tag2, inst80_out);
  and inst81 (inst81_out, write_tag3, inst82_out);
  and inst370 (inst370_out, write_tag4, inst371_out);
  and inst372 (inst372_out, write_tag5, inst373_out);
  and inst374 (inst374_out, write_tag6, inst375_out);
  and inst376 (inst376_out, write_tag7, inst377_out);
  and inst390 (inst390_out, write_tag8, inst391_out);
  and inst392 (inst392_out, write_tag9, inst393_out);
  and inst394 (inst394_out, write_tag10, inst395_out);
  and inst396 (inst396_out, write_tag11, inst397_out);
  and inst410 (inst410_out, write_tag12, inst411_out);
  and inst412 (inst412_out, write_tag13, inst413_out);
  and inst414 (inst414_out, write_tag14, inst415_out);
  and inst416 (inst416_out, write_tag15, inst417_out);
  tag inst8 (.tag_in(address[9:3]), .clk(clk), .write(inst62_out), .tag_out(tag0), .not_free(tag_not_free0));
  tag inst9 (.tag_in(address[9:3]), .clk(clk), .write(inst77_out), .tag_out(tag1), .not_free(tag_not_free1));
  tag inst10 (.tag_in(address[9:3]), .clk(clk), .write(inst79_out), .tag_out(tag2), .not_free(tag_not_free2));
  tag inst11 (.tag_in(address[9:3]), .clk(clk), .write(inst81_out), .tag_out(tag3), .not_free(tag_not_free3));
  tag inst360 (.tag_in(address[9:3]), .clk(clk), .write(inst370_out), .tag_out(tag4), .not_free(tag_not_free4));
  tag inst363 (.tag_in(address[9:3]), .clk(clk), .write(inst372_out), .tag_out(tag5), .not_free(tag_not_free5));
  tag inst366 (.tag_in(address[9:3]), .clk(clk), .write(inst374_out), .tag_out(tag6), .not_free(tag_not_free6));
  tag inst369 (.tag_in(address[9:3]), .clk(clk), .write(inst376_out), .tag_out(tag7), .not_free(tag_not_free7));
  tag inst380 (.tag_in(address[9:3]), .clk(clk), .write(inst390_out), .tag_out(tag8), .not_free(tag_not_free8));
  tag inst383 (.tag_in(address[9:3]), .clk(clk), .write(inst392_out), .tag_out(tag9), .not_free(tag_not_free9));
  tag inst386 (.tag_in(address[9:3]), .clk(clk), .write(inst394_out), .tag_out(tag10), .not_free(tag_not_free10));
  tag inst389 (.tag_in(address[9:3]), .clk(clk), .write(inst396_out), .tag_out(tag11), .not_free(tag_not_free11));
  tag inst400 (.tag_in(address[9:3]), .clk(clk), .write(inst410_out), .tag_out(tag12), .not_free(tag_not_free12));
  tag inst403 (.tag_in(address[9:3]), .clk(clk), .write(inst412_out), .tag_out(tag13), .not_free(tag_not_free13));
  tag inst406 (.tag_in(address[9:3]), .clk(clk), .write(inst414_out), .tag_out(tag14), .not_free(tag_not_free14));
  tag inst409 (.tag_in(address[9:3]), .clk(clk), .write(inst416_out), .tag_out(tag15), .not_free(tag_not_free15));
  not inst150 (inst150_out, int_hit);
  or inst44 (inst44_out, read, write);
  not inst151 (inst151_out, write_ram);
  and inst39 (inst39_out, inst150_out, inst44_out);
  lpm_compare0 inst16 (.dataa(tag0), .datab(address[9:3]), .aeb(inst16_aeb));
  lpm_compare0 inst18 (.dataa(tag1), .datab(address[9:3]), .aeb(inst18_aeb));
  lpm_compare0 inst20 (.dataa(tag2), .datab(address[9:3]), .aeb(inst20_aeb));
  lpm_compare0 inst22 (.dataa(tag3), .datab(address[9:3]), .aeb(inst22_aeb));
  lpm_compare0 inst358 (.dataa(tag4), .datab(address[9:3]), .aeb(inst358_aeb));
  lpm_compare0 inst361 (.dataa(tag5), .datab(address[9:3]), .aeb(inst361_aeb));
  lpm_compare0 inst364 (.dataa(tag6), .datab(address[9:3]), .aeb(inst364_aeb));
  lpm_compare0 inst367 (.dataa(tag7), .datab(address[9:3]), .aeb(inst367_aeb));
  lpm_compare0 inst378 (.dataa(tag8), .datab(address[9:3]), .aeb(inst378_aeb));
  lpm_compare0 inst381 (.dataa(tag9), .datab(address[9:3]), .aeb(inst381_aeb));
  lpm_compare0 inst384 (.dataa(tag10), .datab(address[9:3]), .aeb(inst384_aeb));
  lpm_compare0 inst387 (.dataa(tag11), .datab(address[9:3]), .aeb(inst387_aeb));
  lpm_compare0 inst398 (.dataa(tag12), .datab(address[9:3]), .aeb(inst398_aeb));
  lpm_compare0 inst401 (.dataa(tag13), .datab(address[9:3]), .aeb(inst401_aeb));
  lpm_compare0 inst404 (.dataa(tag14), .datab(address[9:3]), .aeb(inst404_aeb));
  lpm_compare0 inst407 (.dataa(tag15), .datab(address[9:3]), .aeb(inst407_aeb));
  lpm_bustri6 inst42 (.enabledt(write_ram), .data(address[2:0]), .tridata(addr[2:0]));
  assign addr[9:3] = address[9:3];  // WIRE inst4
  and inst70 (inst70_out, inst151_out, inst39_out);
  lpm_or1 inst27 (.data(write_data), .result(inst27_result));
  continuous_ram_control inst98 (.clk(clk), .start(inst70_out), .address(addr[2:0]), .control(ram_read));
  and inst17 (int_hit0, inst16_aeb, tag_not_free0);
  and inst19 (int_hit1, inst18_aeb, tag_not_free1);
  and inst21 (int_hit2, inst20_aeb, tag_not_free2);
  and inst23 (int_hit3, inst22_aeb, tag_not_free3);
  and inst359 (int_hit4, inst358_aeb, tag_not_free4);
  and inst362 (int_hit5, inst361_aeb, tag_not_free5);
  and inst365 (int_hit6, inst364_aeb, tag_not_free6);
  and inst368 (int_hit7, inst367_aeb, tag_not_free7);
  and inst379 (int_hit8, inst378_aeb, tag_not_free8);
  and inst382 (int_hit9, inst381_aeb, tag_not_free9);
  and inst385 (int_hit10, inst384_aeb, tag_not_free10);
  and inst388 (int_hit11, inst387_aeb, tag_not_free11);
  and inst399 (int_hit12, inst398_aeb, tag_not_free12);
  and inst402 (int_hit13, inst401_aeb, tag_not_free13);
  and inst405 (int_hit14, inst404_aeb, tag_not_free14);
  and inst408 (int_hit15, inst407_aeb, tag_not_free15);
  and inst35 (write_ram, write, inst27_result);
  lpm_compare2 inst30 (.dataa(count0), .datab(count1), .aeb(inst30_aeb), .agb(inst30_agb), .alb(\0_win1 ));
  lpm_compare2 inst31 (.dataa(count0), .datab(count2), .aeb(inst31_aeb), .agb(inst31_agb), .alb(\0_win2 ));
  lpm_compare2 inst32 (.dataa(count0), .datab(count3), .aeb(inst32_aeb), .agb(inst32_agb), .alb(\0_win3 ));
  lpm_compare2 inst183 (.dataa(count0), .datab(count4), .aeb(inst183_aeb), .agb(inst183_agb), .alb(\0_win4 ));
  lpm_compare2 inst185 (.dataa(count0), .datab(count5), .aeb(inst185_aeb), .agb(inst185_agb), .alb(\0_win5 ));
  lpm_compare2 inst186 (.dataa(count0), .datab(count6), .aeb(inst186_aeb), .agb(inst186_agb), .alb(\0_win6 ));
  lpm_compare2 inst187 (.dataa(count0), .datab(count7), .aeb(inst187_aeb), .agb(inst187_agb), .alb(\0_win7 ));
  lpm_compare2 inst188 (.dataa(count0), .datab(count8), .aeb(inst188_aeb), .agb(inst188_agb), .alb(\0_win8 ));
  lpm_compare2 inst189 (.dataa(count0), .datab(count9), .aeb(inst189_aeb), .agb(inst189_agb), .alb(\0_win9 ));
  lpm_compare2 inst190 (.dataa(count0), .datab(count10), .aeb(inst190_aeb), .agb(inst190_agb), .alb(\0_win10 ));
  lpm_compare2 inst191 (.dataa(count0), .datab(count11), .aeb(inst191_aeb), .agb(inst191_agb), .alb(\0_win11 ));
  lpm_compare2 inst192 (.dataa(count0), .datab(count12), .aeb(inst192_aeb), .agb(inst192_agb), .alb(\0_win12 ));
  lpm_compare2 inst193 (.dataa(count0), .datab(count13), .aeb(inst193_aeb), .agb(inst193_agb), .alb(\0_win13 ));
  lpm_compare2 inst194 (.dataa(count0), .datab(count14), .aeb(inst194_aeb), .agb(inst194_agb), .alb(\0_win14 ));
  lpm_compare2 inst195 (.dataa(count0), .datab(count15), .aeb(inst195_aeb), .agb(inst195_agb), .alb(\0_win15 ));
  lpm_or0 inst357 (
    .data0(int_hit0), .data1(int_hit1), .data2(int_hit2), .data3(int_hit3), .data4(int_hit4),
    .data5(int_hit5), .data6(int_hit6), .data7(int_hit7), .data8(int_hit8), .data9(int_hit9),
    .data10(int_hit10), .data11(int_hit11), .data12(int_hit12), .data13(int_hit13), .data14(int_hit14),
    .data15(int_hit15), .result(int_hit));
  or inst6 (\1_win1 , inst30_aeb, inst30_agb);
  or inst13 (\4_win1 , inst183_aeb, inst183_agb);
  or inst24 (\5_win1 , inst185_aeb, inst185_agb);
  or inst25 (\6_win1 , inst186_aeb, inst186_agb);
  or inst26 (\7_win1 , inst187_aeb, inst187_agb);
  or inst28 (\8_win1 , inst188_aeb, inst188_agb);
  or inst29 (\9_win1 , inst189_aeb, inst189_agb);
  or inst33 (\10_win1 , inst190_aeb, inst190_agb);
  or inst46 (\11_win1 , inst191_aeb, inst191_agb);
  or inst47 (\12_win1 , inst192_aeb, inst192_agb);
  or inst49 (\13_win1 , inst193_aeb, inst193_agb);
  or inst52 (\14_win1 , inst194_aeb, inst194_agb);
  or inst53 (\15_win1 , inst195_aeb, inst195_agb);
  or inst7 (\2_win1 , inst31_aeb, inst31_agb);
  or inst12 (\3_win1 , inst32_aeb, inst32_agb);
  not inst63 (inst63_out, inst112_out);
  or inst112 (inst112_out, write, read);
  not inst100 (inst100_out, clk);
  lpm_mux4 inst65 (.data1(inst63_out), .data0(inst112_out), .sel(hit), .result(inst65_result));
  lpm_and1 inst184 (
    .data0(\0_win1 ), .data1(\0_win2 ), .data2(\0_win3 ), .data3(\0_win4 ), .data4(\0_win5 ),
    .data5(\0_win6 ), .data6(\0_win7 ), .data7(\0_win8 ), .data8(\0_win9 ), .data9(\0_win10 ),
    .data10(\0_win11 ), .data11(\0_win12 ), .data12(\0_win13 ), .data13(\0_win14 ), .data14(\0_win15 ),
    .result(win0));
  lpm_and1 inst298 (
    .data0(\1_win1 ), .data1(\1_win2 ), .data2(\1_win3 ), .data3(\1_win4 ), .data4(\1_win5 ),
    .data5(\1_win6 ), .data6(\1_win7 ), .data7(\1_win8 ), .data8(\1_win9 ), .data9(\1_win10 ),
    .data10(\1_win11 ), .data11(\1_win12 ), .data12(\1_win13 ), .data13(\1_win14 ), .data14(\1_win15 ),
    .result(win1));
  lpm_and1 inst299 (
    .data0(\2_win1 ), .data1(\2_win2 ), .data2(\2_win3 ), .data3(\2_win4 ), .data4(\2_win5 ),
    .data5(\2_win6 ), .data6(\2_win7 ), .data7(\2_win8 ), .data8(\2_win9 ), .data9(\2_win10 ),
    .data10(\2_win11 ), .data11(\2_win12 ), .data12(\2_win13 ), .data13(\2_win14 ), .data14(\2_win15 ),
    .result(win2));
  lpm_and1 inst300 (
    .data0(\3_win1 ), .data1(\3_win2 ), .data2(\3_win3 ), .data3(\3_win4 ), .data4(\3_win5 ),
    .data5(\3_win6 ), .data6(\3_win7 ), .data7(\3_win8 ), .data8(\3_win9 ), .data9(\3_win10 ),
    .data10(\3_win11 ), .data11(\3_win12 ), .data12(\3_win13 ), .data13(\3_win14 ), .data14(\3_win15 ),
    .result(win3));
  lpm_compare2 inst37 (.dataa(count1), .datab(count2), .aeb(inst37_aeb), .agb(inst37_agb), .alb(\1_win2 ));
  lpm_compare2 inst38 (.dataa(count1), .datab(count3), .aeb(inst38_aeb), .agb(inst38_agb), .alb(\1_win3 ));
  lpm_compare2 inst196 (.dataa(count1), .datab(count4), .aeb(inst196_aeb), .agb(inst196_agb), .alb(\1_win4 ));
  lpm_compare2 inst197 (.dataa(count1), .datab(count5), .aeb(inst197_aeb), .agb(inst197_agb), .alb(\1_win5 ));
  lpm_compare2 inst198 (.dataa(count1), .datab(count6), .aeb(inst198_aeb), .agb(inst198_agb), .alb(\1_win6 ));
  lpm_compare2 inst199 (.dataa(count1), .datab(count7), .aeb(inst199_aeb), .agb(inst199_agb), .alb(\1_win7 ));
  lpm_compare2 inst200 (.dataa(count1), .datab(count8), .aeb(inst200_aeb), .agb(inst200_agb), .alb(\1_win8 ));
  lpm_compare2 inst201 (.dataa(count1), .datab(count9), .aeb(inst201_aeb), .agb(inst201_agb), .alb(\1_win9 ));
  lpm_compare2 inst202 (.dataa(count1), .datab(count10), .aeb(inst202_aeb), .agb(inst202_agb), .alb(\1_win10 ));
  lpm_compare2 inst203 (.dataa(count1), .datab(count11), .aeb(inst203_aeb), .agb(inst203_agb), .alb(\1_win11 ));
  lpm_compare2 inst204 (.dataa(count1), .datab(count12), .aeb(inst204_aeb), .agb(inst204_agb), .alb(\1_win12 ));
  lpm_compare2 inst205 (.dataa(count1), .datab(count13), .aeb(inst205_aeb), .agb(inst205_agb), .alb(\1_win13 ));
  lpm_compare2 inst206 (.dataa(count1), .datab(count14), .aeb(inst206_aeb), .agb(inst206_agb), .alb(\1_win14 ));
  lpm_compare2 inst207 (.dataa(count1), .datab(count15), .aeb(inst207_aeb), .agb(inst207_agb), .alb(\1_win15 ));
  lpm_mux4 inst50 (.data1(inst100_out), .data0(hit), .sel(inst64_q), .result(inst50_result));
  TFFE inst66 (.T(1'b1), .CLK(inst65_result), .ENA(int_hit), .Q(hit));  // open: CLRN, PRN
  TFF inst64 (.T(1'b1), .CLK(inst50_result), .Q(inst64_q));  // open: PRN, CLRN
  or inst58 (\2_win2 , inst37_aeb, inst37_agb);
  or inst72 (\3_win2 , inst38_aeb, inst38_agb);
  or inst73 (\4_win2 , inst196_aeb, inst196_agb);
  or inst75 (\5_win2 , inst197_aeb, inst197_agb);
  or inst99 (\6_win2 , inst198_aeb, inst198_agb);
  or inst101 (\7_win2 , inst199_aeb, inst199_agb);
  or inst102 (\8_win2 , inst200_aeb, inst200_agb);
  or inst103 (\9_win2 , inst201_aeb, inst201_agb);
  or inst104 (\10_win2 , inst202_aeb, inst202_agb);
  or inst107 (\11_win2 , inst203_aeb, inst203_agb);
  or inst108 (\12_win2 , inst204_aeb, inst204_agb);
  or inst111 (\13_win2 , inst205_aeb, inst205_agb);
  or inst115 (\14_win2 , inst206_aeb, inst206_agb);
  or inst117 (\15_win2 , inst207_aeb, inst207_agb);
  lpm_and1 inst301 (
    .data0(\4_win1 ), .data1(\4_win2 ), .data2(\4_win3 ), .data3(\4_win4 ), .data4(\4_win5 ),
    .data5(\4_win6 ), .data6(\4_win7 ), .data7(\4_win8 ), .data8(\4_win9 ), .data9(\4_win10 ),
    .data10(\4_win11 ), .data11(\4_win12 ), .data12(\4_win13 ), .data13(\4_win14 ), .data14(\4_win15 ),
    .result(win4));
  lpm_and1 inst302 (
    .data0(\5_win1 ), .data1(\5_win2 ), .data2(\5_win3 ), .data3(\5_win4 ), .data4(\5_win5 ),
    .data5(\5_win6 ), .data6(\5_win7 ), .data7(\5_win8 ), .data8(\5_win9 ), .data9(\5_win10 ),
    .data10(\5_win11 ), .data11(\5_win12 ), .data12(\5_win13 ), .data13(\5_win14 ), .data14(\5_win15 ),
    .result(win5));
  lpm_and1 inst303 (
    .data0(\6_win1 ), .data1(\6_win2 ), .data2(\6_win3 ), .data3(\6_win4 ), .data4(\6_win5 ),
    .data5(\6_win6 ), .data6(\6_win7 ), .data7(\6_win8 ), .data8(\6_win9 ), .data9(\6_win10 ),
    .data10(\6_win11 ), .data11(\6_win12 ), .data12(\6_win13 ), .data13(\6_win14 ), .data14(\6_win15 ),
    .result(win6));
  lpm_and1 inst304 (
    .data0(\7_win1 ), .data1(\7_win2 ), .data2(\7_win3 ), .data3(\7_win4 ), .data4(\7_win5 ),
    .data5(\7_win6 ), .data6(\7_win7 ), .data7(\7_win8 ), .data8(\7_win9 ), .data9(\7_win10 ),
    .data10(\7_win11 ), .data11(\7_win12 ), .data12(\7_win13 ), .data13(\7_win14 ), .data14(\7_win15 ),
    .result(win7));
  and inst109 (cache_line_read, inst64_q, read);
  and inst110 (inst110_out, inst64_q, write);
  lpm_compare2 inst40 (.dataa(count2), .datab(count3), .aeb(inst40_aeb), .agb(inst40_agb), .alb(\2_win3 ));
  lpm_compare2 inst208 (.dataa(count2), .datab(count4), .aeb(inst208_aeb), .agb(inst208_agb), .alb(\2_win4 ));
  lpm_compare2 inst209 (.dataa(count2), .datab(count5), .aeb(inst209_aeb), .agb(inst209_agb), .alb(\2_win5 ));
  lpm_compare2 inst210 (.dataa(count2), .datab(count6), .aeb(inst210_aeb), .agb(inst210_agb), .alb(\2_win6 ));
  lpm_compare2 inst211 (.dataa(count2), .datab(count7), .aeb(inst211_aeb), .agb(inst211_agb), .alb(\2_win7 ));
  lpm_compare2 inst212 (.dataa(count2), .datab(count8), .aeb(inst212_aeb), .agb(inst212_agb), .alb(\2_win8 ));
  lpm_compare2 inst213 (.dataa(count2), .datab(count9), .aeb(inst213_aeb), .agb(inst213_agb), .alb(\2_win9 ));
  lpm_compare2 inst214 (.dataa(count2), .datab(count10), .aeb(inst214_aeb), .agb(inst214_agb), .alb(\2_win10 ));
  lpm_compare2 inst215 (.dataa(count2), .datab(count11), .aeb(inst215_aeb), .agb(inst215_agb), .alb(\2_win11 ));
  lpm_compare2 inst216 (.dataa(count2), .datab(count12), .aeb(inst216_aeb), .agb(inst216_agb), .alb(\2_win12 ));
  lpm_compare2 inst217 (.dataa(count2), .datab(count13), .aeb(inst217_aeb), .agb(inst217_agb), .alb(\2_win13 ));
  lpm_compare2 inst218 (.dataa(count2), .datab(count14), .aeb(inst218_aeb), .agb(inst218_agb), .alb(\2_win14 ));
  lpm_compare2 inst219 (.dataa(count2), .datab(count15), .aeb(inst219_aeb), .agb(inst219_agb), .alb(\2_win15 ));
  lpm_and1 inst305 (
    .data0(\8_win1 ), .data1(\8_win2 ), .data2(\8_win3 ), .data3(\8_win4 ), .data4(\8_win5 ),
    .data5(\8_win6 ), .data6(\8_win7 ), .data7(\8_win8 ), .data8(\8_win9 ), .data9(\8_win10 ),
    .data10(\8_win11 ), .data11(\8_win12 ), .data12(\8_win13 ), .data13(\8_win14 ), .data14(\8_win15 ),
    .result(win8));
  lpm_and1 inst306 (
    .data0(\9_win1 ), .data1(\9_win2 ), .data2(\9_win3 ), .data3(\9_win4 ), .data4(\9_win5 ),
    .data5(\9_win6 ), .data6(\9_win7 ), .data7(\9_win8 ), .data8(\9_win9 ), .data9(\9_win10 ),
    .data10(\9_win11 ), .data11(\9_win12 ), .data12(\9_win13 ), .data13(\9_win14 ), .data14(\9_win15 ),
    .result(win9));
  lpm_and1 inst307 (
    .data0(\10_win1 ), .data1(\10_win2 ), .data2(\10_win3 ), .data3(\10_win4 ), .data4(\10_win5 ),
    .data5(\10_win6 ), .data6(\10_win7 ), .data7(\10_win8 ), .data8(\10_win9 ), .data9(\10_win10 ),
    .data10(\10_win11 ), .data11(\10_win12 ), .data12(\10_win13 ), .data13(\10_win14 ), .data14(\10_win15 ),
    .result(win10));
  lpm_and1 inst308 (
    .data0(\11_win1 ), .data1(\11_win2 ), .data2(\11_win3 ), .data3(\11_win4 ), .data4(\11_win5 ),
    .data5(\11_win6 ), .data6(\11_win7 ), .data7(\11_win8 ), .data8(\11_win9 ), .data9(\11_win10 ),
    .data10(\11_win11 ), .data11(\11_win12 ), .data12(\11_win13 ), .data13(\11_win14 ), .data14(\11_win15 ),
    .result(win11));
  DFF inst119 (.CLK(clk), .D(inst110_out), .Q(cache_write));  // open: CLRN, PRN
  or inst118 (\3_win3 , inst40_aeb, inst40_agb);
  or inst121 (\4_win3 , inst208_aeb, inst208_agb);
  or inst123 (\5_win3 , inst209_aeb, inst209_agb);
  or inst125 (\6_win3 , inst210_aeb, inst210_agb);
  or inst145 (\7_win3 , inst211_aeb, inst211_agb);
  or inst146 (\8_win3 , inst212_aeb, inst212_agb);
  or inst147 (\9_win3 , inst213_aeb, inst213_agb);
  or inst148 (\10_win3 , inst214_aeb, inst214_agb);
  or inst149 (\11_win3 , inst215_aeb, inst215_agb);
  or inst152 (\12_win3 , inst216_aeb, inst216_agb);
  or inst153 (\13_win3 , inst217_aeb, inst217_agb);
  or inst154 (\14_win3 , inst218_aeb, inst218_agb);
  or inst155 (\15_win3 , inst219_aeb, inst219_agb);
  lpm_and1 inst309 (
    .data0(\12_win1 ), .data1(\12_win2 ), .data2(\12_win3 ), .data3(\12_win4 ), .data4(\12_win5 ),
    .data5(\12_win6 ), .data6(\12_win7 ), .data7(\12_win8 ), .data8(\12_win9 ), .data9(\12_win10 ),
    .data10(\12_win11 ), .data11(\12_win12 ), .data12(\12_win13 ), .data13(\12_win14 ), .data14(\12_win15 ),
    .result(win12));
  lpm_and1 inst310 (
    .data0(\13_win1 ), .data1(\13_win2 ), .data2(\13_win3 ), .data3(\13_win4 ), .data4(\13_win5 ),
    .data5(\13_win6 ), .data6(\13_win7 ), .data7(\13_win8 ), .data8(\13_win9 ), .data9(\13_win10 ),
    .data10(\13_win11 ), .data11(\13_win12 ), .data12(\13_win13 ), .data13(\13_win14 ), .data14(\13_win15 ),
    .result(win13));
  lpm_and1 inst311 (
    .data0(\14_win1 ), .data1(\14_win2 ), .data2(\14_win3 ), .data3(\14_win4 ), .data4(\14_win5 ),
    .data5(\14_win6 ), .data6(\14_win7 ), .data7(\14_win8 ), .data8(\14_win9 ), .data9(\14_win10 ),
    .data10(\14_win11 ), .data11(\14_win12 ), .data12(\14_win13 ), .data13(\14_win14 ), .data14(\14_win15 ),
    .result(win14));
  lpm_and1 inst312 (
    .data0(\15_win1 ), .data1(\15_win2 ), .data2(\15_win3 ), .data3(\15_win4 ), .data4(\15_win5 ),
    .data5(\15_win6 ), .data6(\15_win7 ), .data7(\15_win8 ), .data8(\15_win9 ), .data9(\15_win10 ),
    .data10(\15_win11 ), .data11(\15_win12 ), .data12(\15_win13 ), .data13(\15_win14 ), .data14(\15_win15 ),
    .result(win15));
  lpm_compare2 inst220 (.dataa(count3), .datab(count4), .aeb(inst220_aeb), .agb(inst220_agb), .alb(\3_win4 ));
  lpm_compare2 inst221 (.dataa(count3), .datab(count5), .aeb(inst221_aeb), .agb(inst221_agb), .alb(\3_win5 ));
  lpm_compare2 inst222 (.dataa(count3), .datab(count6), .aeb(inst222_aeb), .agb(inst222_agb), .alb(\3_win6 ));
  lpm_compare2 inst223 (.dataa(count3), .datab(count7), .aeb(inst223_aeb), .agb(inst223_agb), .alb(\3_win7 ));
  lpm_compare2 inst224 (.dataa(count3), .datab(count8), .aeb(inst224_aeb), .agb(inst224_agb), .alb(\3_win8 ));
  lpm_compare2 inst225 (.dataa(count3), .datab(count9), .aeb(inst225_aeb), .agb(inst225_agb), .alb(\3_win9 ));
  lpm_compare2 inst226 (.dataa(count3), .datab(count10), .aeb(inst226_aeb), .agb(inst226_agb), .alb(\3_win10 ));
  lpm_compare2 inst227 (.dataa(count3), .datab(count11), .aeb(inst227_aeb), .agb(inst227_agb), .alb(\3_win11 ));
  lpm_compare2 inst228 (.dataa(count3), .datab(count12), .aeb(inst228_aeb), .agb(inst228_agb), .alb(\3_win12 ));
  lpm_compare2 inst229 (.dataa(count3), .datab(count13), .aeb(inst229_aeb), .agb(inst229_agb), .alb(\3_win13 ));
  lpm_compare2 inst230 (.dataa(count3), .datab(count14), .aeb(inst230_aeb), .agb(inst230_agb), .alb(\3_win14 ));
  lpm_compare2 inst231 (.dataa(count3), .datab(count15), .aeb(inst231_aeb), .agb(inst231_agb), .alb(\3_win15 ));
  or inst156 (\4_win4 , inst220_aeb, inst220_agb);
  or inst157 (\5_win4 , inst221_aeb, inst221_agb);
  or inst158 (\6_win4 , inst222_aeb, inst222_agb);
  or inst159 (\7_win4 , inst223_aeb, inst223_agb);
  or inst160 (\8_win4 , inst224_aeb, inst224_agb);
  or inst161 (\9_win4 , inst225_aeb, inst225_agb);
  or inst162 (\10_win4 , inst226_aeb, inst226_agb);
  or inst163 (\11_win4 , inst227_aeb, inst227_agb);
  or inst164 (\12_win4 , inst228_aeb, inst228_agb);
  or inst165 (\13_win4 , inst229_aeb, inst229_agb);
  or inst166 (\14_win4 , inst230_aeb, inst230_agb);
  or inst167 (\15_win4 , inst231_aeb, inst231_agb);
  lpm_compare2 inst232 (.dataa(count4), .datab(count5), .aeb(inst232_aeb), .agb(inst232_agb), .alb(\4_win5 ));
  lpm_compare2 inst233 (.dataa(count4), .datab(count6), .aeb(inst233_aeb), .agb(inst233_agb), .alb(\4_win6 ));
  lpm_compare2 inst234 (.dataa(count4), .datab(count7), .aeb(inst234_aeb), .agb(inst234_agb), .alb(\4_win7 ));
  lpm_compare2 inst235 (.dataa(count4), .datab(count8), .aeb(inst235_aeb), .agb(inst235_agb), .alb(\4_win8 ));
  lpm_compare2 inst236 (.dataa(count4), .datab(count9), .aeb(inst236_aeb), .agb(inst236_agb), .alb(\4_win9 ));
  lpm_compare2 inst237 (.dataa(count4), .datab(count10), .aeb(inst237_aeb), .agb(inst237_agb), .alb(\4_win10 ));
  lpm_compare2 inst238 (.dataa(count4), .datab(count11), .aeb(inst238_aeb), .agb(inst238_agb), .alb(\4_win11 ));
  lpm_compare2 inst239 (.dataa(count4), .datab(count12), .aeb(inst239_aeb), .agb(inst239_agb), .alb(\4_win12 ));
  lpm_compare2 inst240 (.dataa(count4), .datab(count13), .aeb(inst240_aeb), .agb(inst240_agb), .alb(\4_win13 ));
  lpm_compare2 inst241 (.dataa(count4), .datab(count14), .aeb(inst241_aeb), .agb(inst241_agb), .alb(\4_win14 ));
  lpm_compare2 inst242 (.dataa(count4), .datab(count15), .aeb(inst242_aeb), .agb(inst242_agb), .alb(\4_win15 ));
  or inst168 (\5_win5 , inst232_aeb, inst232_agb);
  or inst169 (\6_win5 , inst233_aeb, inst233_agb);
  or inst170 (\7_win5 , inst234_aeb, inst234_agb);
  or inst171 (\8_win5 , inst235_aeb, inst235_agb);
  or inst172 (\9_win5 , inst236_aeb, inst236_agb);
  or inst175 (\10_win5 , inst237_aeb, inst237_agb);
  or inst176 (\11_win5 , inst238_aeb, inst238_agb);
  or inst177 (\12_win5 , inst239_aeb, inst239_agb);
  or inst178 (\13_win5 , inst240_aeb, inst240_agb);
  or inst179 (\14_win5 , inst241_aeb, inst241_agb);
  or inst180 (\15_win5 , inst242_aeb, inst242_agb);
  lpm_compare2 inst243 (.dataa(count5), .datab(count6), .aeb(inst243_aeb), .agb(inst243_agb), .alb(\5_win6 ));
  lpm_compare2 inst244 (.dataa(count5), .datab(count7), .aeb(inst244_aeb), .agb(inst244_agb), .alb(\5_win7 ));
  lpm_compare2 inst245 (.dataa(count5), .datab(count8), .aeb(inst245_aeb), .agb(inst245_agb), .alb(\5_win8 ));
  lpm_compare2 inst246 (.dataa(count5), .datab(count9), .aeb(inst246_aeb), .agb(inst246_agb), .alb(\5_win9 ));
  lpm_compare2 inst247 (.dataa(count5), .datab(count10), .aeb(inst247_aeb), .agb(inst247_agb), .alb(\5_win10 ));
  lpm_compare2 inst248 (.dataa(count5), .datab(count11), .aeb(inst248_aeb), .agb(inst248_agb), .alb(\5_win11 ));
  lpm_compare2 inst249 (.dataa(count5), .datab(count12), .aeb(inst249_aeb), .agb(inst249_agb), .alb(\5_win12 ));
  lpm_compare2 inst250 (.dataa(count5), .datab(count13), .aeb(inst250_aeb), .agb(inst250_agb), .alb(\5_win13 ));
  lpm_compare2 inst251 (.dataa(count5), .datab(count14), .aeb(inst251_aeb), .agb(inst251_agb), .alb(\5_win14 ));
  lpm_compare2 inst252 (.dataa(count5), .datab(count15), .aeb(inst252_aeb), .agb(inst252_agb), .alb(\5_win15 ));
  or inst181 (\6_win6 , inst243_aeb, inst243_agb);
  or inst419 (\7_win6 , inst244_aeb, inst244_agb);
  or inst450 (\8_win6 , inst245_aeb, inst245_agb);
  or inst451 (\9_win6 , inst246_aeb, inst246_agb);
  or inst453 (\10_win6 , inst247_aeb, inst247_agb);
  or inst454 (\11_win6 , inst248_aeb, inst248_agb);
  or inst456 (\12_win6 , inst249_aeb, inst249_agb);
  or inst457 (\13_win6 , inst250_aeb, inst250_agb);
  or inst459 (\14_win6 , inst251_aeb, inst251_agb);
  or inst460 (\15_win6 , inst252_aeb, inst252_agb);
  lpm_compare2 inst253 (.dataa(count6), .datab(count7), .aeb(inst253_aeb), .agb(inst253_agb), .alb(\6_win7 ));
  lpm_compare2 inst254 (.dataa(count6), .datab(count8), .aeb(inst254_aeb), .agb(inst254_agb), .alb(\6_win8 ));
  lpm_compare2 inst255 (.dataa(count6), .datab(count9), .aeb(inst255_aeb), .agb(inst255_agb), .alb(\6_win9 ));
  lpm_compare2 inst256 (.dataa(count6), .datab(count10), .aeb(inst256_aeb), .agb(inst256_agb), .alb(\6_win10 ));
